# EAGLE schematic urdevboard (EAGLE 5.06)

## Sheet 1 of 11
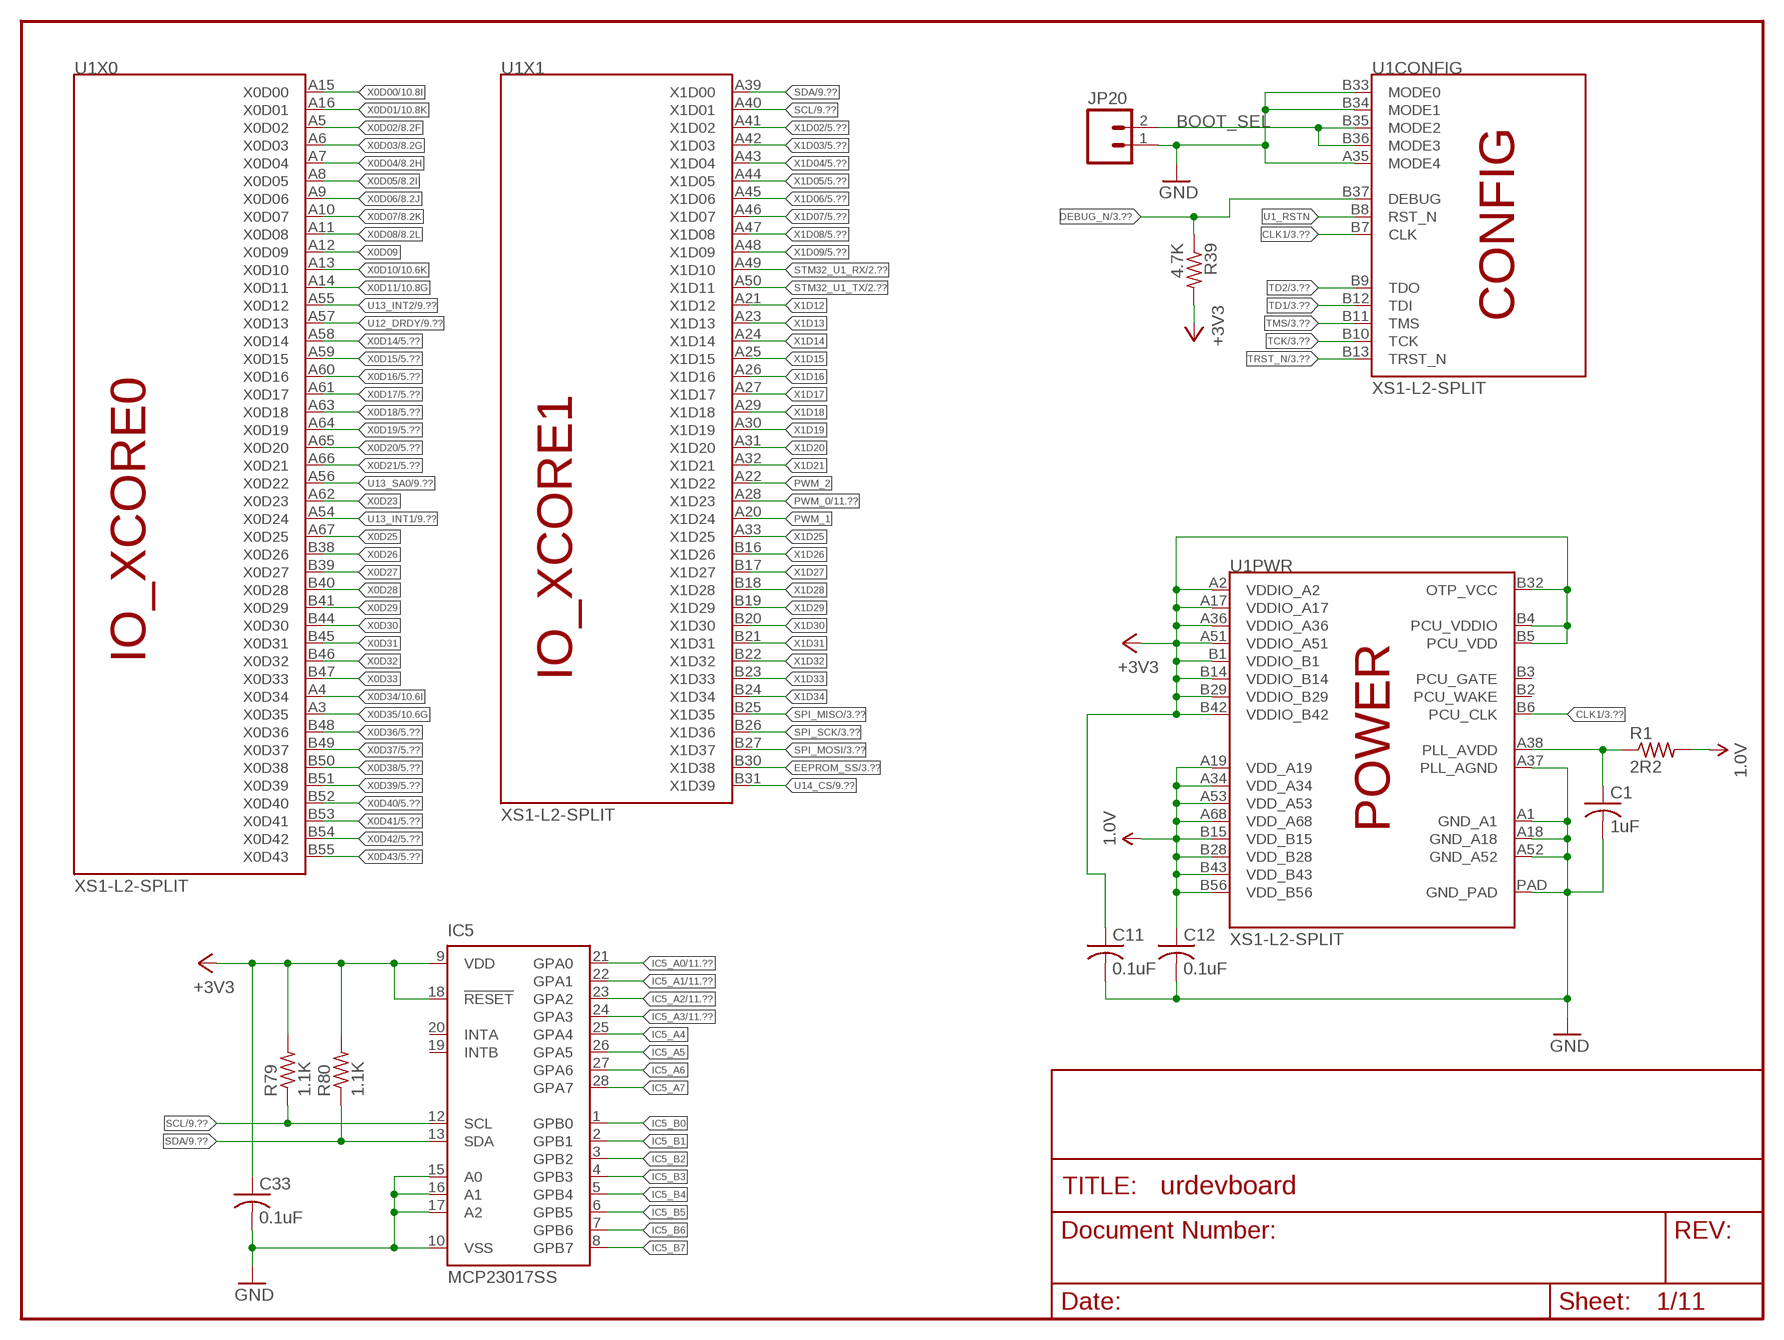
[diagram p0: schematic, sheet 1]

### Parts
C1  1uF  C-USC0603  [C0603]
C11  0.1uF  C-USC0603  [C0603]
C12  0.1uF  C-USC0603  [C0603]
C33  0.1uF  C-USC0603  [C0603]
IC5  MCP23017SS  [SSOP28]
JP20  M02PTH  [1X02]
R1  2R2  R-US_R0603  [R0603]
R39  4.7K  R-US_R0603  [R0603]
R79  1.1K  R-US_R0603  [R0603]
R80  1.1K  R-US_R0603  [R0603]
U1  XS1-L2-SPLIT  [124QFN]

### Nets
1.0V: C12.1 R1.2 U1.A19(PWR:VDD_A19) U1.A34(PWR:VDD_A34) U1.A53(PWR:VDD_A53) U1.A68(PWR:VDD_A68) U1.B15(PWR:VDD_B15) U1.B28(PWR:VDD_B28) U1.B43(PWR:VDD_B43) U1.B56(PWR:VDD_B56) ; also sheet 4
+3V3: C11.1 C33.1 IC5.9(VDD) IC5.18(!RESET) R39.2 R79.2 R80.2 U1.A2(PWR:VDDIO_A2) U1.A17(PWR:VDDIO_A17) U1.A36(PWR:VDDIO_A36) U1.A51(PWR:VDDIO_A51) U1.B1(PWR:VDDIO_B1) U1.B4(PWR:PCU_VDDIO) U1.B5(PWR:PCU_VDD) U1.B14(PWR:VDDIO_B14) U1.B29(PWR:VDDIO_B29) U1.B32(PWR:OTP_VCC) U1.B42(PWR:VDDIO_B42) ; also sheet 2,3,4,5,6,7,8,9,11
BOOT_SEL: JP20.2 U1.B35(CONFIG:MODE2) U1.B36(CONFIG:MODE3)
CLK1: U1.B6(PWR:PCU_CLK) U1.B7(CONFIG:CLK) ; also sheet 3
DEBUG_N: R39.1 U1.B37(CONFIG:DEBUG) ; also sheet 3
EEPROM_SS: U1.B30(X1:X1D38) ; also sheet 3
GND: C1.2 C11.2 C12.2 C33.2 IC5.10(VSS) IC5.15(A0) IC5.16(A1) IC5.17(A2) JP20.1 U1.A1(PWR:GND_A1) U1.A18(PWR:GND_A18) U1.A35(CONFIG:MODE4) U1.A37(PWR:PLL_AGND) U1.A52(PWR:GND_A52) U1.B33(CONFIG:MODE0) U1.B34(CONFIG:MODE1) U1.PAD(PWR:GND_PAD) ; also sheet 2,3,4,5,9,10,11
IC5_A0: IC5.21(GPA0) ; also sheet 11
IC5_A1: IC5.22(GPA1) ; also sheet 11
IC5_A2: IC5.23(GPA2) ; also sheet 11
IC5_A3: IC5.24(GPA3) ; also sheet 11
IC5_A4: IC5.25(GPA4)
IC5_A5: IC5.26(GPA5)
IC5_A6: IC5.27(GPA6)
IC5_A7: IC5.28(GPA7)
IC5_B0: IC5.1(GPB0)
IC5_B1: IC5.2(GPB1)
IC5_B2: IC5.3(GPB2)
IC5_B3: IC5.4(GPB3)
IC5_B4: IC5.5(GPB4)
IC5_B5: IC5.6(GPB5)
IC5_B6: IC5.7(GPB6)
IC5_B7: IC5.8(GPB7)
PWM_0: U1.A28(X1:X1D23) ; also sheet 11
PWM_1: U1.A20(X1:X1D24)
PWM_2: U1.A22(X1:X1D22)
SCL: IC5.12(SCL) R79.1 U1.A40(X1:X1D01) ; also sheet 9
SDA: IC5.13(SDA) R80.1 U1.A39(X1:X1D00) ; also sheet 9
SPI_MISO: U1.B25(X1:X1D35) ; also sheet 3,9
SPI_MOSI: U1.B27(X1:X1D37) ; also sheet 3,9
SPI_SCK: U1.B26(X1:X1D36) ; also sheet 3,9
STM32_U1_RX: U1.A49(X1:X1D10) ; also sheet 2
STM32_U1_TX: U1.A50(X1:X1D11) ; also sheet 2
TCK: U1.B10(CONFIG:TCK) ; also sheet 3
TD1: U1.B12(CONFIG:TDI) ; also sheet 3
TD2: U1.B9(CONFIG:TDO) ; also sheet 3
TMS: U1.B11(CONFIG:TMS) ; also sheet 3
TRST_N: U1.B13(CONFIG:TRST_N) ; also sheet 3
U1_PLL_AVDD: C1.1 R1.1 U1.A38(PWR:PLL_AVDD)
U1_RSTN: U1.B8(CONFIG:RST_N)
U12_DRDY: U1.A57(X0:X0D13) ; also sheet 9
U13_INT1: U1.A54(X0:X0D24) ; also sheet 9
U13_INT2: U1.A55(X0:X0D12) ; also sheet 9
U13_SA0: U1.A56(X0:X0D22) ; also sheet 9
U14_CS: U1.B31(X1:X1D39) ; also sheet 9
X0D00: U1.A15(X0:X0D00) ; also sheet 10
X0D01: U1.A16(X0:X0D01) ; also sheet 10
X0D02: U1.A5(X0:X0D02) ; also sheet 8
X0D03: U1.A6(X0:X0D03) ; also sheet 8
X0D04: U1.A7(X0:X0D04) ; also sheet 8
X0D05: U1.A8(X0:X0D05) ; also sheet 8
X0D06: U1.A9(X0:X0D06) ; also sheet 8
X0D07: U1.A10(X0:X0D07) ; also sheet 8
X0D08: U1.A11(X0:X0D08) ; also sheet 8
X0D09: U1.A12(X0:X0D09)
X0D10: U1.A13(X0:X0D10) ; also sheet 10
X0D11: U1.A14(X0:X0D11) ; also sheet 10
X0D14: U1.A58(X0:X0D14) ; also sheet 5
X0D15: U1.A59(X0:X0D15) ; also sheet 5
X0D16: U1.A60(X0:X0D16) ; also sheet 5
X0D17: U1.A61(X0:X0D17) ; also sheet 5
X0D18: U1.A63(X0:X0D18) ; also sheet 5
X0D19: U1.A64(X0:X0D19) ; also sheet 5
X0D20: U1.A65(X0:X0D20) ; also sheet 5
X0D21: U1.A66(X0:X0D21) ; also sheet 5
X0D23: U1.A62(X0:X0D23)
X0D25: U1.A67(X0:X0D25)
X0D26: U1.B38(X0:X0D26)
X0D27: U1.B39(X0:X0D27)
X0D28: U1.B40(X0:X0D28)
X0D29: U1.B41(X0:X0D29)
X0D30: U1.B44(X0:X0D30)
X0D31: U1.B45(X0:X0D31)
X0D32: U1.B46(X0:X0D32)
X0D33: U1.B47(X0:X0D33)
X0D34: U1.A4(X0:X0D34) ; also sheet 10
X0D35: U1.A3(X0:X0D35) ; also sheet 10
X0D36: U1.B48(X0:X0D36) ; also sheet 5
X0D37: U1.B49(X0:X0D37) ; also sheet 5
X0D38: U1.B50(X0:X0D38) ; also sheet 5
X0D39: U1.B51(X0:X0D39) ; also sheet 5
X0D40: U1.B52(X0:X0D40) ; also sheet 5
X0D41: U1.B53(X0:X0D41) ; also sheet 5
X0D42: U1.B54(X0:X0D42) ; also sheet 5
X0D43: U1.B55(X0:X0D43) ; also sheet 5
X1D02: U1.A41(X1:X1D02) ; also sheet 5
X1D03: U1.A42(X1:X1D03) ; also sheet 5
X1D04: U1.A43(X1:X1D04) ; also sheet 5
X1D05: U1.A44(X1:X1D05) ; also sheet 5
X1D06: U1.A45(X1:X1D06) ; also sheet 5
X1D07: U1.A46(X1:X1D07) ; also sheet 5
X1D08: U1.A47(X1:X1D08) ; also sheet 5
X1D09: U1.A48(X1:X1D09) ; also sheet 5
X1D12: U1.A21(X1:X1D12)
X1D13: U1.A23(X1:X1D13)
X1D14: U1.A24(X1:X1D14)
X1D15: U1.A25(X1:X1D15)
X1D16: U1.A26(X1:X1D16)
X1D17: U1.A27(X1:X1D17)
X1D18: U1.A29(X1:X1D18)
X1D19: U1.A30(X1:X1D19)
X1D20: U1.A31(X1:X1D20)
X1D21: U1.A32(X1:X1D21)
X1D25: U1.A33(X1:X1D25)
X1D26: U1.B16(X1:X1D26)
X1D27: U1.B17(X1:X1D27)
X1D28: U1.B18(X1:X1D28)
X1D29: U1.B19(X1:X1D29)
X1D30: U1.B20(X1:X1D30)
X1D31: U1.B21(X1:X1D31)
X1D32: U1.B22(X1:X1D32)
X1D33: U1.B23(X1:X1D33)
X1D34: U1.B24(X1:X1D34)
Unconnected: IC5.19(INTB) IC5.20(INTA) U1.B2(PWR:PCU_WAKE) U1.B3(PWR:PCU_GATE)

## Sheet 2 of 11
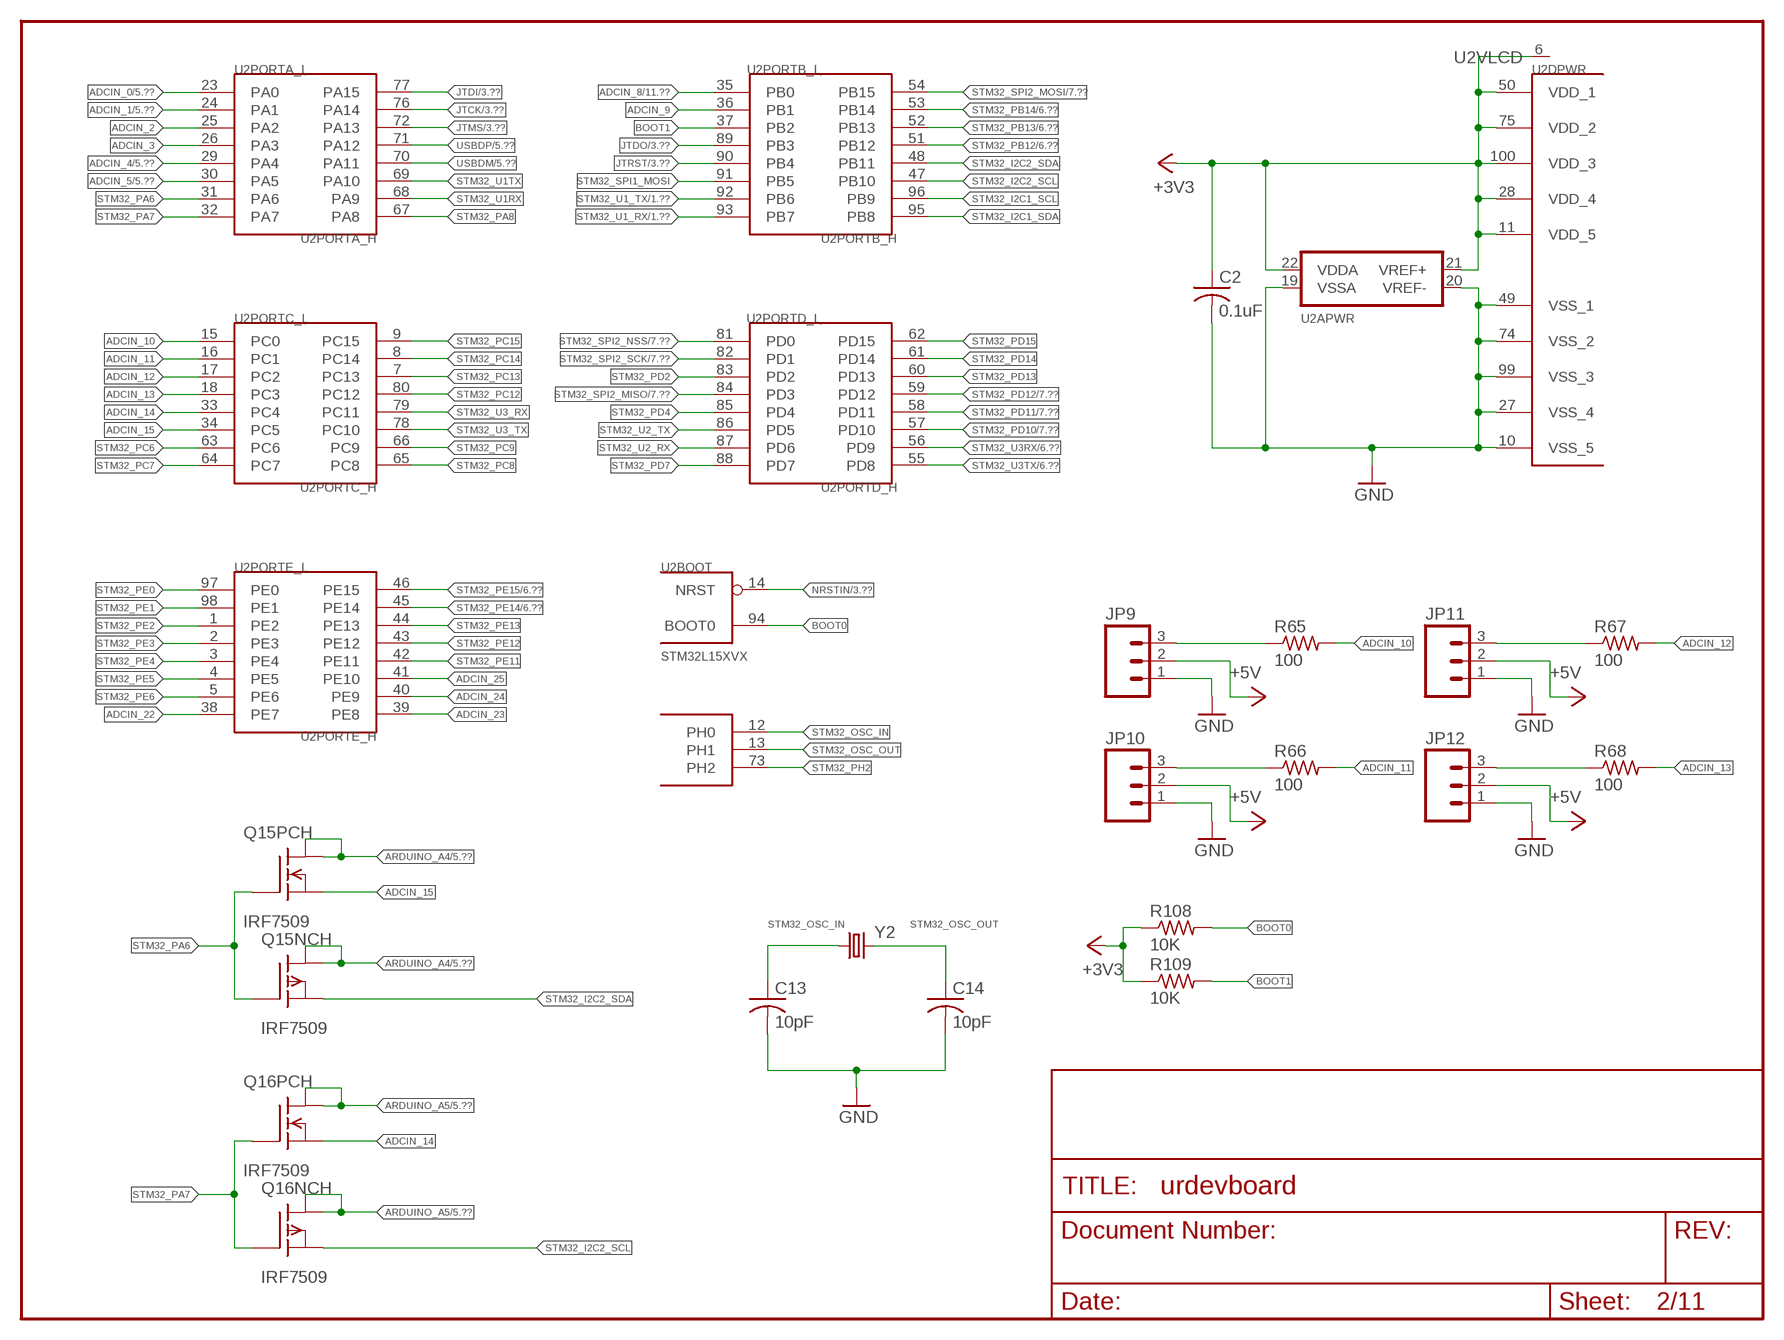
[diagram p1: schematic, sheet 2]

### Parts
C2  0.1uF  C-USC0603  [C0603]
C13  10pF  C-USC0603  [C0603]
C14  10pF  C-USC0603  [C0603]
JP9  M03PTH  [1X03]
JP10  M03PTH  [1X03]
JP11  M03PTH  [1X03]
JP12  M03PTH  [1X03]
Q15  IRF7509  IRF7509"  [MICRO8]
Q16  IRF7509  IRF7509"  [MICRO8]
R65  100  R-US_R0603  [R0603]
R66  100  R-US_R0603  [R0603]
R67  100  R-US_R0603  [R0603]
R68  100  R-US_R0603  [R0603]
R108  10K  R-US_R0603  [R0603]
R109  10K  R-US_R0603  [R0603]
U2  STM32L15XVX  [LQFP100]
Y2  CRYSTALHC49US  [HC49US]

### Nets
+3V3: C2.1 R108.1 R109.1 U2.11(DPWR:VDD_5) U2.21(APWR:VREF+) U2.22(APWR:VDDA) U2.28(DPWR:VDD_4) U2.50(DPWR:VDD_1) U2.75(DPWR:VDD_2) U2.100(DPWR:VDD_3) ; also sheet 1,3,4,5,6,7,8,9,11
+5V: JP9.2 JP10.2 JP11.2 JP12.2 ; also sheet 4,5,6,7,8
ADCIN_0: U2.23(PORTA_L:PA0) ; also sheet 5
ADCIN_1: U2.24(PORTA_L:PA1) ; also sheet 5
ADCIN_2: U2.25(PORTA_L:PA2)
ADCIN_3: U2.26(PORTA_L:PA3)
ADCIN_4: U2.29(PORTA_L:PA4) ; also sheet 5
ADCIN_5: U2.30(PORTA_L:PA5) ; also sheet 5
ADCIN_8: U2.35(PORTB_L:PB0) ; also sheet 11
ADCIN_9: U2.36(PORTB_L:PB1)
ADCIN_10: R65.2 U2.15(PORTC_L:PC0)
ADCIN_11: R66.2 U2.16(PORTC_L:PC1)
ADCIN_12: R67.2 U2.17(PORTC_L:PC2)
ADCIN_13: R68.2 U2.18(PORTC_L:PC3)
ADCIN_14: Q16.1(PCH:S) U2.33(PORTC_L:PC4)
ADCIN_15: Q15.1(PCH:S) U2.34(PORTC_L:PC5)
ADCIN_22: U2.38(PORTE_L:PE7)
ADCIN_23: U2.39(PORTE_H:PE8)
ADCIN_24: U2.40(PORTE_H:PE9)
ADCIN_25: U2.41(PORTE_H:PE10)
ARDUINO_A4: Q15.5(NCH:D) Q15.6(NCH:D1) Q15.7(PCH:D) Q15.8(PCH:D1) ; also sheet 5
ARDUINO_A5: Q16.5(NCH:D) Q16.6(NCH:D1) Q16.7(PCH:D) Q16.8(PCH:D1) ; also sheet 5
BOOT0: R108.2 U2.94(BOOT:BOOT0)
BOOT1: R109.2 U2.37(PORTB_L:PB2)
EXTERNAL_ADC_0: JP9.3 R65.1
EXTERNAL_ADC_1: JP10.3 R66.1
EXTERNAL_ADC_2: JP11.3 R67.1
EXTERNAL_ADC_3: JP12.3 R68.1
GND: C2.2 C13.2 C14.2 JP9.1 JP10.1 JP11.1 JP12.1 U2.10(DPWR:VSS_5) U2.19(APWR:VSSA) U2.20(APWR:VREF-) U2.27(DPWR:VSS_4) U2.49(DPWR:VSS_1) U2.74(DPWR:VSS_2) U2.99(DPWR:VSS_3) ; also sheet 1,3,4,5,9,10,11
JTCK: U2.76(PORTA_H:PA14) ; also sheet 3
JTDI: U2.77(PORTA_H:PA15) ; also sheet 3
JTDO: U2.89(PORTB_L:PB3) ; also sheet 3
JTMS: U2.72(PORTA_H:PA13) ; also sheet 3
JTRST: U2.90(PORTB_L:PB4) ; also sheet 3
NRSTIN: U2.14(BOOT:NRST) ; also sheet 3,5
STM32_I2C1_SCL: U2.96(PORTB_H:PB9)
STM32_I2C1_SDA: U2.95(PORTB_H:PB8)
STM32_I2C2_SCL: Q16.3(NCH:S) U2.47(PORTB_H:PB10)
STM32_I2C2_SDA: Q15.3(NCH:S) U2.48(PORTB_H:PB11)
STM32_OSC_IN: C13.1 U2.12(PORTH:PH0) Y2.1
STM32_OSC_OUT: C14.1 U2.13(PORTH:PH1) Y2.2
STM32_PA6: Q15.2(PCH:G) Q15.4(NCH:G) U2.31(PORTA_L:PA6)
STM32_PA7: Q16.2(PCH:G) Q16.4(NCH:G) U2.32(PORTA_L:PA7)
STM32_PA8: U2.67(PORTA_H:PA8)
STM32_PB12: U2.51(PORTB_H:PB12) ; also sheet 6
STM32_PB13: U2.52(PORTB_H:PB13) ; also sheet 6
STM32_PB14: U2.53(PORTB_H:PB14) ; also sheet 6
STM32_PC6: U2.63(PORTC_L:PC6)
STM32_PC7: U2.64(PORTC_L:PC7)
STM32_PC8: U2.65(PORTC_H:PC8)
STM32_PC9: U2.66(PORTC_H:PC9)
STM32_PC12: U2.80(PORTC_H:PC12)
STM32_PC13: U2.7(PORTC_H:PC13)
STM32_PC14: U2.8(PORTC_H:PC14)
STM32_PC15: U2.9(PORTC_H:PC15)
STM32_PD2: U2.83(PORTD_L:PD2)
STM32_PD4: U2.85(PORTD_L:PD4)
STM32_PD7: U2.88(PORTD_L:PD7)
STM32_PD10: U2.57(PORTD_H:PD10) ; also sheet 7
STM32_PD11: U2.58(PORTD_H:PD11) ; also sheet 7
STM32_PD12: U2.59(PORTD_H:PD12) ; also sheet 7
STM32_PD13: U2.60(PORTD_H:PD13)
STM32_PD14: U2.61(PORTD_H:PD14)
STM32_PD15: U2.62(PORTD_H:PD15)
STM32_PE0: U2.97(PORTE_L:PE0)
STM32_PE1: U2.98(PORTE_L:PE1)
STM32_PE2: U2.1(PORTE_L:PE2)
STM32_PE3: U2.2(PORTE_L:PE3)
STM32_PE4: U2.3(PORTE_L:PE4)
STM32_PE5: U2.4(PORTE_L:PE5)
STM32_PE6: U2.5(PORTE_L:PE6)
STM32_PE11: U2.42(PORTE_H:PE11)
STM32_PE12: U2.43(PORTE_H:PE12)
STM32_PE13: U2.44(PORTE_H:PE13)
STM32_PE14: U2.45(PORTE_H:PE14) ; also sheet 6
STM32_PE15: U2.46(PORTE_H:PE15) ; also sheet 6
STM32_PH2: U2.73(PORTH:PH2)
STM32_SPI1_MOSI: U2.91(PORTB_L:PB5)
STM32_SPI2_MISO: U2.84(PORTD_L:PD3) ; also sheet 7
STM32_SPI2_MOSI: U2.54(PORTB_H:PB15) ; also sheet 7
STM32_SPI2_NSS: U2.81(PORTD_L:PD0) ; also sheet 7
STM32_SPI2_SCK: U2.82(PORTD_L:PD1) ; also sheet 7
STM32_U1_RX: U2.93(PORTB_L:PB7) ; also sheet 1
STM32_U1_TX: U2.92(PORTB_L:PB6) ; also sheet 1
STM32_U1RX: U2.68(PORTA_H:PA9)
STM32_U1TX: U2.69(PORTA_H:PA10)
STM32_U2_RX: U2.87(PORTD_L:PD6)
STM32_U2_TX: U2.86(PORTD_L:PD5)
STM32_U3_RX: U2.79(PORTC_H:PC11)
STM32_U3_TX: U2.78(PORTC_H:PC10)
STM32_U3RX: U2.56(PORTD_H:PD9) ; also sheet 6
STM32_U3TX: U2.55(PORTD_H:PD8) ; also sheet 6
USBDM: U2.70(PORTA_H:PA11) ; also sheet 5
USBDP: U2.71(PORTA_H:PA12) ; also sheet 5

## Sheet 3 of 11
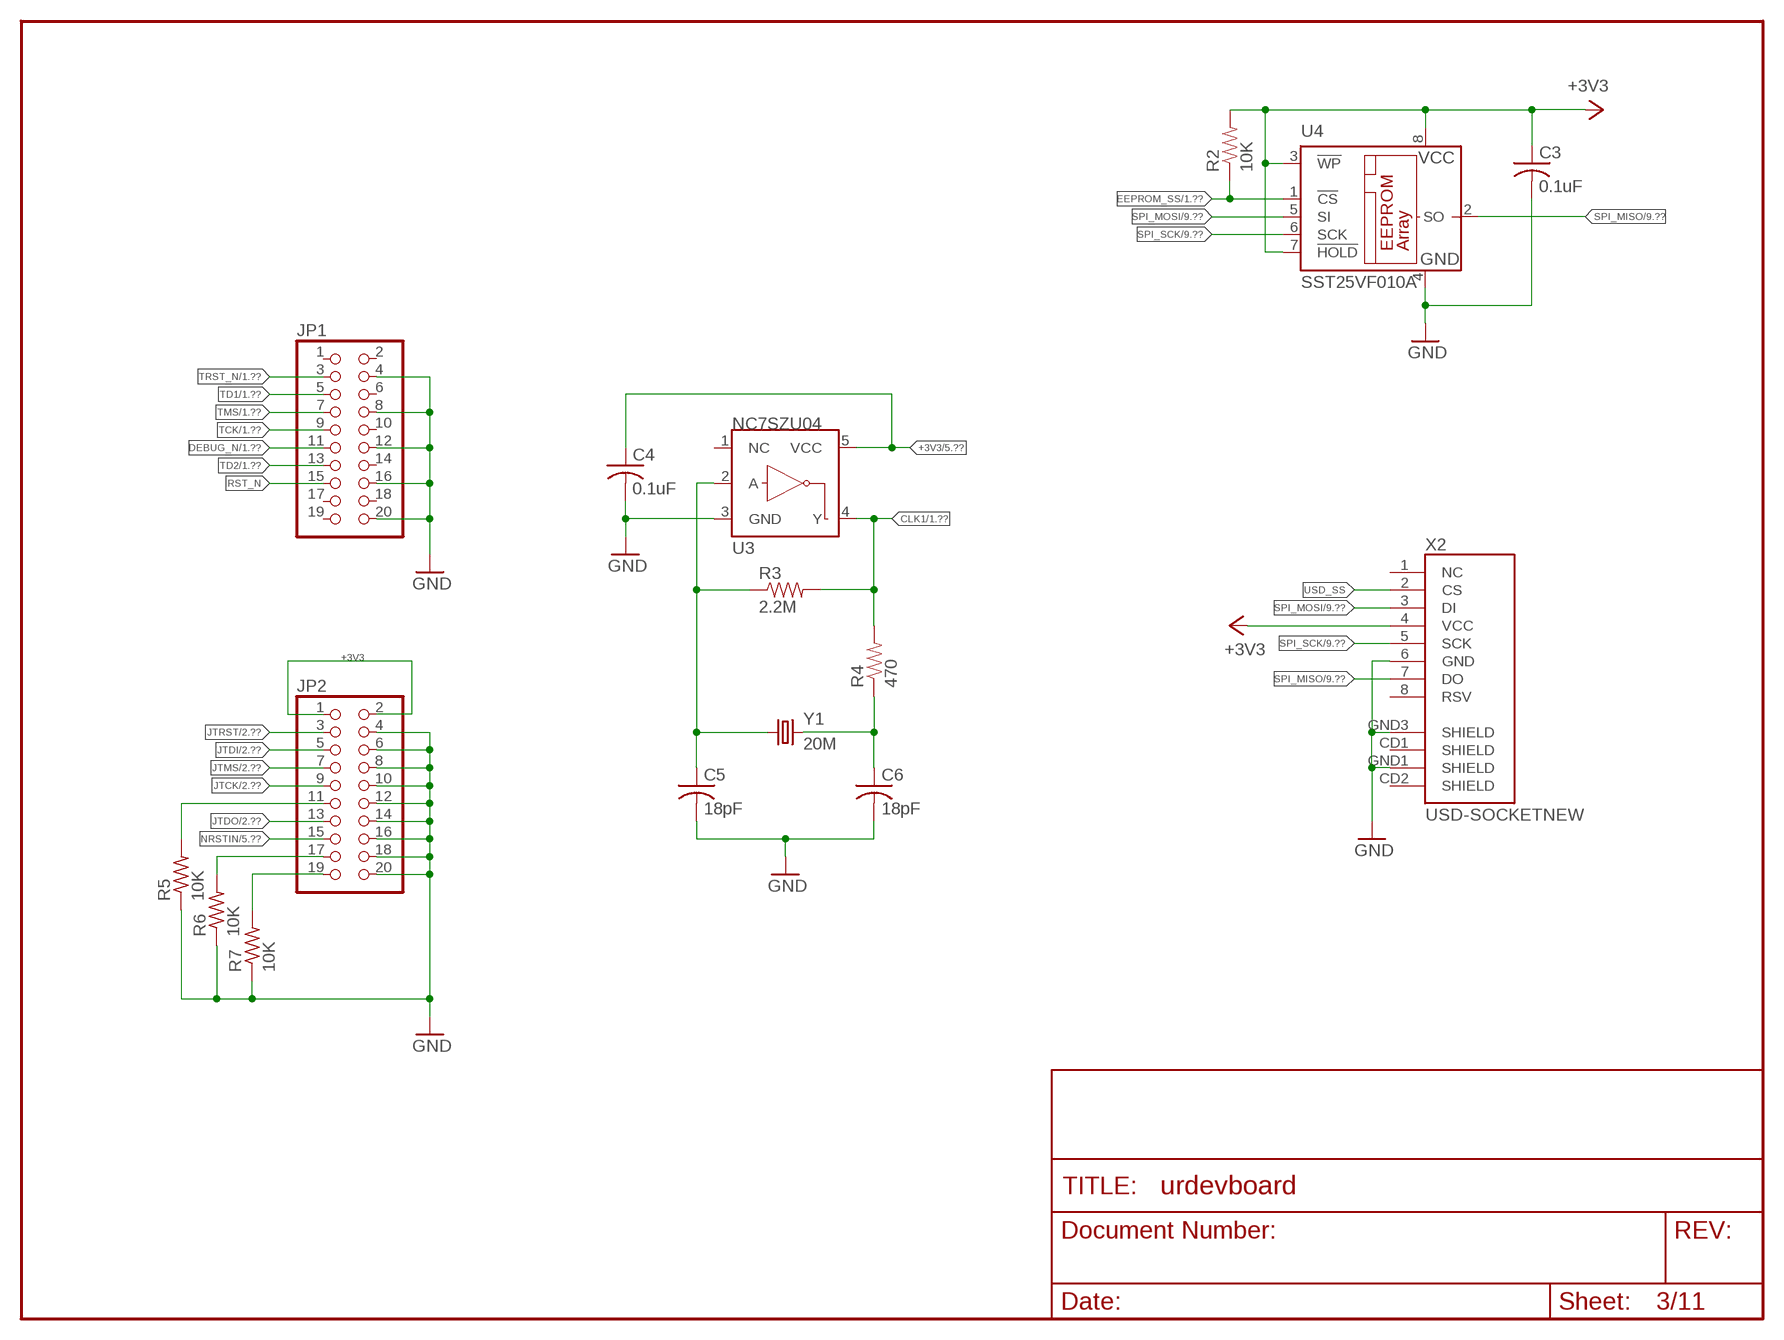
[diagram p2: schematic, sheet 3]

### Parts
C3  0.1uF  C-USC0603  [C0603]
C4  0.1uF  C-USC0603  [C0603]
C5  18pF  C-USC0603  [C0603]
C6  18pF  C-USC0603  [C0603]
JP1  PINHD-2X10  [2X10]
JP2  PINHD-2X10  [2X10]
R2  10K  RESISTOR0603-RES  [0603-RES]
R3  2.2M  RESISTOR0603-RES  [0603-RES]
R4  470  RESISTOR0603-RES  [0603-RES]
R5  10K  R-US_R0603  [R0603]
R6  10K  R-US_R0603  [R0603]
R7  10K  R-US_R0603  [R0603]
U3  NC7SZU04  INVERTER""  [SC70]
U4  SST25VF010A  25LC080SN  [SO-08]
X2  USD-SOCKETNEW  [MICRO-SD-SOCKET-PP]
Y1  20M  CRYSTALHC49US  [HC49US]

### Nets
+3V3: C3.1 C4.1 JP2.1 JP2.2 R2.2 U3.5(VCC) U4.3(!WP) U4.7(!HOLD) U4.8(VCC) X2.4(VCC) ; also sheet 1,2,4,5,6,7,8,9,11
CLK1: R3.2 R4.2 U3.4(Y) ; also sheet 1
DBGACK: JP2.19 R7.2
DBGRQ: JP2.17 R6.2
DEBUG_N: JP1.11 ; also sheet 1
EEPROM_SS: R2.1 U4.1(!CS) ; also sheet 1
GND: C3.2 C4.2 C5.2 C6.2 JP1.4 JP1.8 JP1.12 JP1.16 JP1.20 JP2.4 JP2.6 JP2.8 JP2.10 JP2.12 JP2.14 JP2.16 JP2.18 JP2.20 R5.1 R6.1 R7.1 U3.3(GND) U4.4(GND) X2.6(GND) X2.GND1(SHIELD) X2.GND3(SHIELD) ; also sheet 1,2,4,5,9,10,11
JTCK: JP2.9 ; also sheet 2
JTDI: JP2.5 ; also sheet 2
JTDO: JP2.13 ; also sheet 2
JTMS: JP2.7 ; also sheet 2
JTRST: JP2.3 ; also sheet 2
NRSTIN: JP2.15 ; also sheet 2,5
RST_N: JP1.15
RTCK: JP2.11 R5.2
SPI_MISO: U4.2(SO) X2.7(DO) ; also sheet 1,9
SPI_MOSI: U4.5(SI) X2.3(DI) ; also sheet 1,9
SPI_SCK: U4.6(SCK) X2.5(SCK) ; also sheet 1,9
TCK: JP1.9 ; also sheet 1
TD1: JP1.5 ; also sheet 1
TD2: JP1.13 ; also sheet 1
TMS: JP1.7 ; also sheet 1
TRST_N: JP1.3 ; also sheet 1
USD_SS: X2.2(CS)
Y1INVA-: C5.1 R3.1 U3.2(A) Y1.1
Y1RES: C6.1 R4.1 Y1.2
Unconnected: JP1.1 JP1.2 JP1.6 JP1.10 JP1.14 JP1.17 JP1.18 JP1.19 U3.1(NC) X2.1(NC) X2.8(RSV) X2.CD1(SHIELD) X2.CD2(SHIELD)

## Sheet 4 of 11
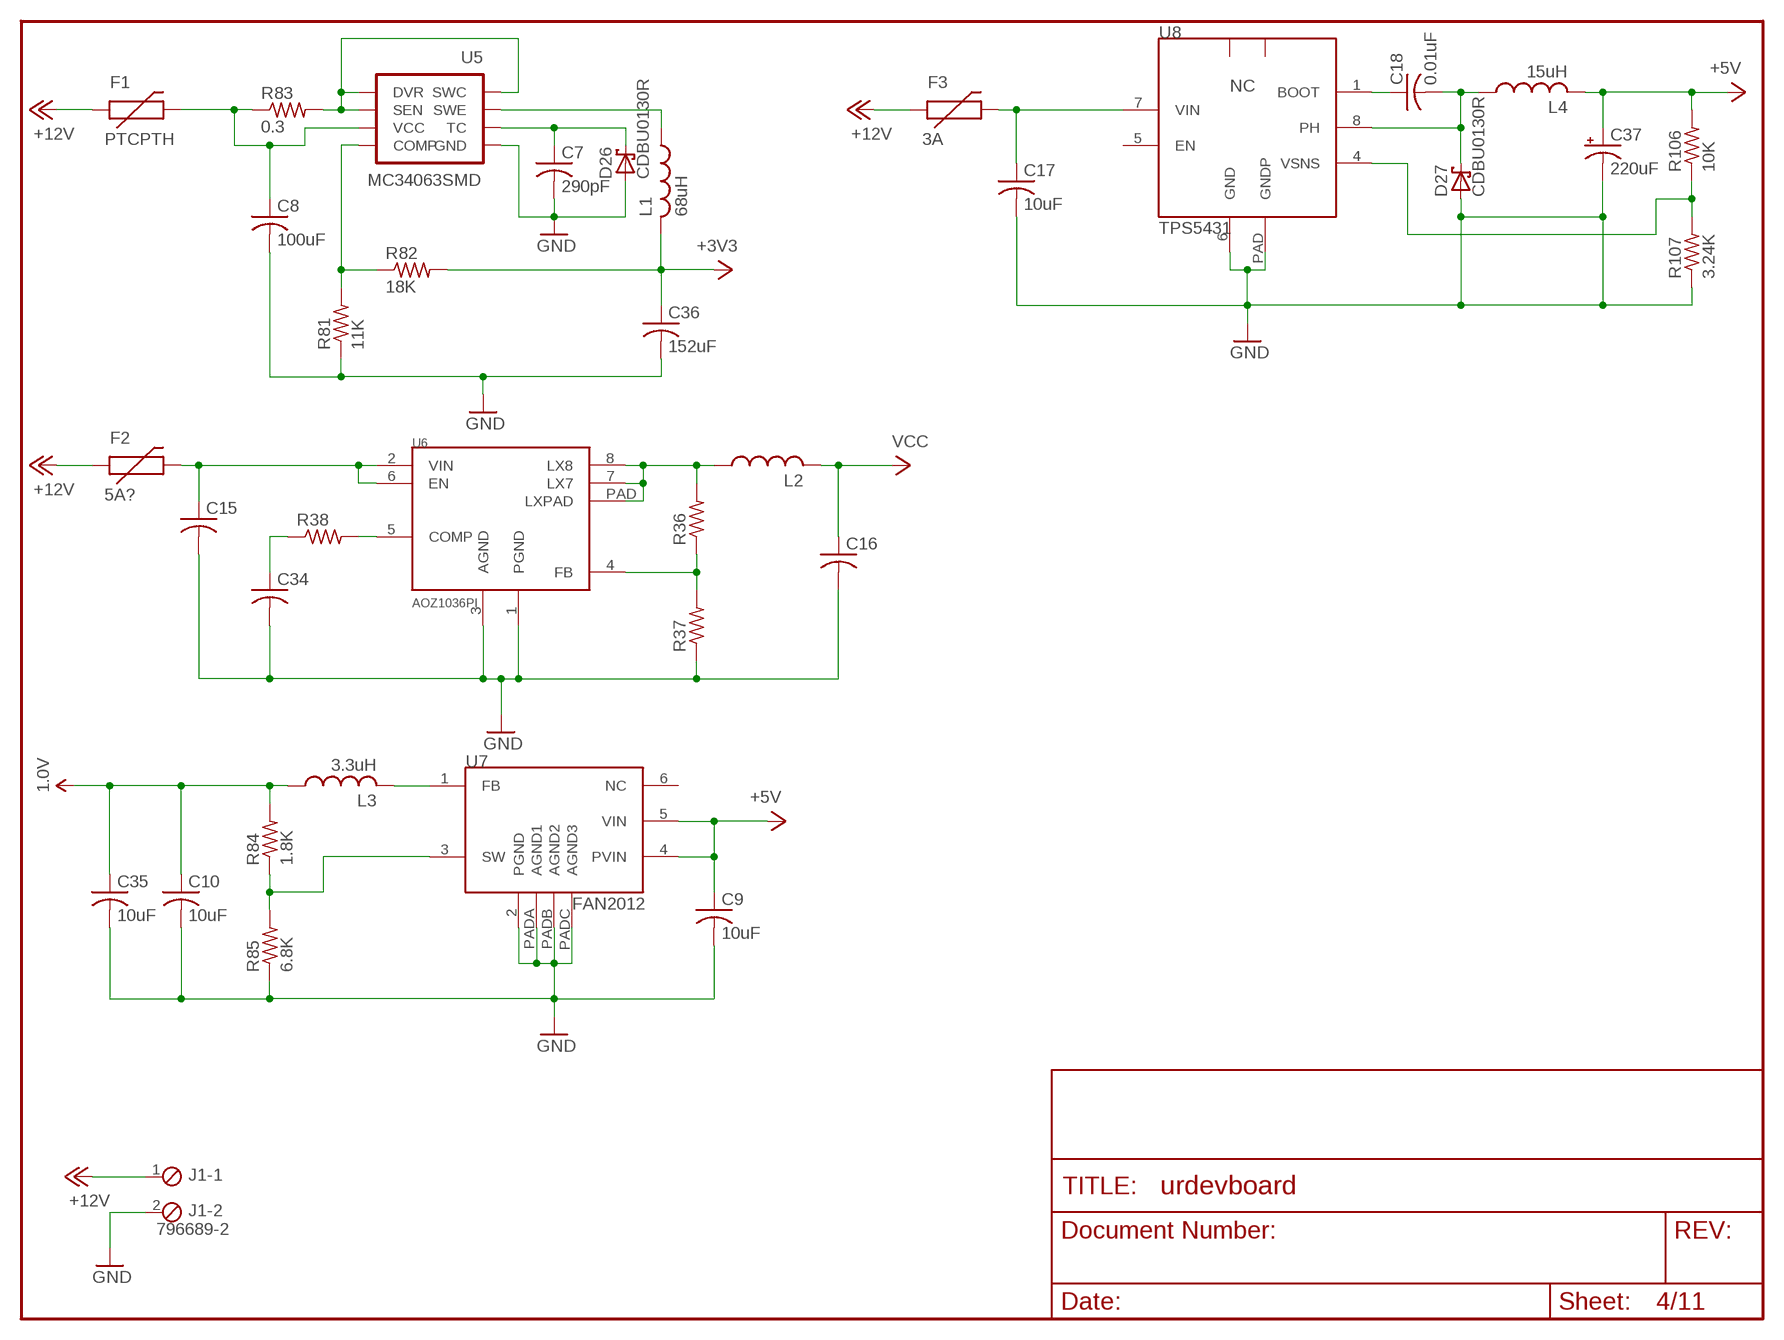
[diagram p3: schematic, sheet 4]

### Parts
C7  290pF  C-USC0603  [C0603]
C8  100uF  C-USC0805  [C0805]
C9  10uF  C-USC0805  [C0805]
C10  10uF  C-USC0805  [C0805]
C15  C-USC1206  [C1206]
C16  C-USC0603  [C0603]
C17  10uF  C-USC0805  [C0805]
C18  0.01uF  C-USC0603  [C0603]
C34  C-USC0603  [C0603]
C35  10uF  C-USC0805  [C0805]
C36  152uF  C-USC0805  [C0805]
C37  220uF  CPOL-USD  [PANASONIC_D]
D26  CDBU0130R  [D0603]
D27  CDBU0130R  [D0603]
F1  PTCPTH  [PTC]
F2  5A?  PTCPTH  [PTC]
F3  3A  PTCPTH  [PTC]
J1  796689-2  [796689-2]
L1  68uH  L-USSLF12565  [SLF12565]
L2  L-USSLF12565  [SLF12565]
L3  3.3uH  L-USPANASONIC_ELL6  [PANASONIC_ELL6]
L4  15uH  L-USIHLP-3232DZ  [IHLP-3232DZ]
R36  R-US_R1206  [R1206]
R37  R-US_R0603  [R0603]
R38  R-US_R0603  [R0603]
R81  11K  R-US_R0603  [R0603]
R82  18K  R-US_R0603  [R0603]
R83  0.3  R-US_R0603  [R0603]
R84  1.8K  R-US_R0603  [R0603]
R85  6.8K  R-US_R0603  [R0603]
R106  10K  R-US_R0603  [R0603]
R107  3.24K  R-US_R0603  [R0603]
U5  MC34063SMD  [SO08]
U6  AOZ1036PI  [SO8_EP1]
U7  FAN2012  [MLP6]
U8  TPS5431  [R-PDSO-G08]

### Nets
1.0V: C10.1 C35.1 L3.1 R84.2 ; also sheet 1
+3V3: C36.1 L1.2 R82.2 ; also sheet 1,2,3,5,6,7,8,9,11
+5V: C9.1 C37.+ L4.2 R106.2 U7.4(PVIN) U7.5(VIN) ; also sheet 2,5,6,7,8
+12V: F1.P$1 F2.P$1 F3.P$1 J1.1 ; also sheet 11
F3_OUT: C17.1 F3.P$2 U8.7(VIN)
GND: C7.2 C8.2 C9.2 C10.2 C15.2 C16.2 C17.2 C34.2 C35.2 C36.2 C37.- D26.A D27.A J1.2 R37.1 R81.1 R85.1 R107.1 U5.4(GND) U6.1(PGND) U6.3(AGND) U7.2(PGND) U7.PADA(AGND1) U7.PADB(AGND2) U7.PADC(AGND3) U8.6(GND) U8.PAD(GNDP) ; also sheet 1,2,3,5,9,10,11
U5_COMP: R81.2 R82.1 U5.5(COMP)
U5_FB: R36.1 R37.2 U6.4(FB)
U5_SWC: R83.2 U5.1(SWC) U5.7(SEN) U5.8(DVR)
U5_SWE: L1.1 U5.2(SWE)
U5_TC: C7.1 D26.C U5.3(TC)
U5_VCC: C8.1 F1.P$2 R83.1 U5.6(VCC)
U6_COMP: R38.2 U6.5(COMP)
U6_LX: L2.1 R36.2 U6.7(LX7) U6.8(LX8) U6.PAD(LXPAD)
U6_RC: C34.1 R38.1
U6_VIN: C15.1 F2.P$2 U6.2(VIN) U6.6(EN)
U7_FB: L3.2 U7.1(FB)
U7_SW: R84.1 R85.2 U7.3(SW)
U8_BOOT: C18.1 U8.1(BOOT)
U8_PH: C18.2 D27.C L4.1 U8.8(PH)
U8_VSNS: R106.1 R107.2 U8.4(VSNS)
VCC: C16.1 L2.2 ; also sheet 10
Unconnected: U7.6(NC) U8.2(NC1) U8.3(NC2) U8.5(EN)

## Sheet 5 of 11
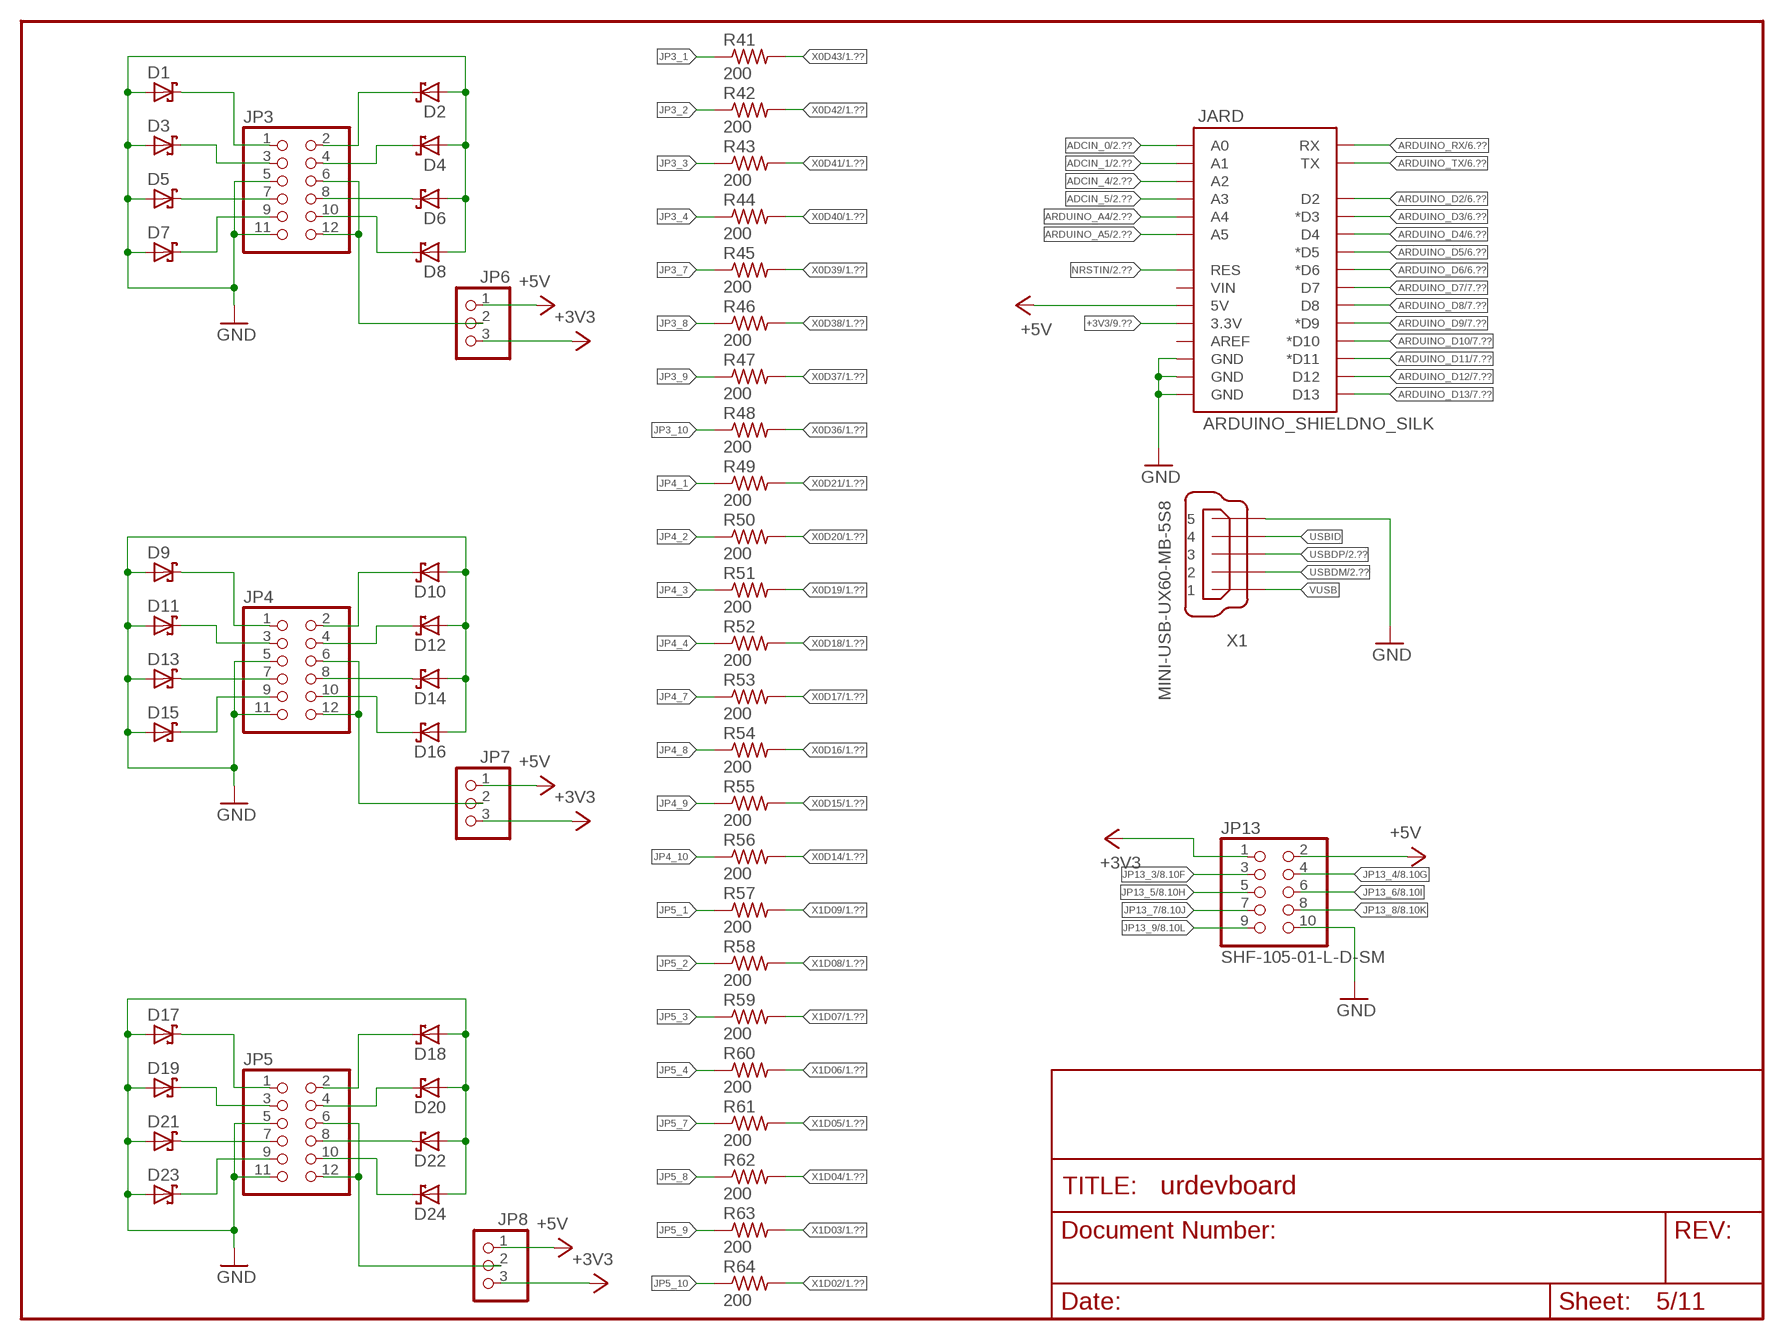
[diagram p4: schematic, sheet 5]

### Parts
D1  CDBU0130R  [D0603]
D2  CDBU0130R  [D0603]
D3  CDBU0130R  [D0603]
D4  CDBU0130R  [D0603]
D5  CDBU0130R  [D0603]
D6  CDBU0130R  [D0603]
D7  CDBU0130R  [D0603]
D8  CDBU0130R  [D0603]
D9  CDBU0130R  [D0603]
D10  CDBU0130R  [D0603]
D11  CDBU0130R  [D0603]
D12  CDBU0130R  [D0603]
D13  CDBU0130R  [D0603]
D14  CDBU0130R  [D0603]
D15  CDBU0130R  [D0603]
D16  CDBU0130R  [D0603]
D17  CDBU0130R  [D0603]
D18  CDBU0130R  [D0603]
D19  CDBU0130R  [D0603]
D20  CDBU0130R  [D0603]
D21  CDBU0130R  [D0603]
D22  CDBU0130R  [D0603]
D23  CDBU0130R  [D0603]
D24  CDBU0130R  [D0603]
JARD  ARDUINO_SHIELDNO_SILK  [DUEMILANOVE_VIAS]
JP3  PINHD-2X6  [2X06]
JP4  PINHD-2X6  [2X06]
JP5  PINHD-2X6  [2X06]
JP6  PINHD-1X3  [1X03]
JP7  PINHD-1X3  [1X03]
JP8  PINHD-1X3  [1X03]
JP13  SHF-105-01-L-D-SM  [SHF-105-01-L-D-SM]
R41  200  R-US_R0603  [R0603]
R42  200  R-US_R0603  [R0603]
R43  200  R-US_R0603  [R0603]
R44  200  R-US_R0603  [R0603]
R45  200  R-US_R0603  [R0603]
R46  200  R-US_R0603  [R0603]
R47  200  R-US_R0603  [R0603]
R48  200  R-US_R0603  [R0603]
R49  200  R-US_R0603  [R0603]
R50  200  R-US_R0603  [R0603]
R51  200  R-US_R0603  [R0603]
R52  200  R-US_R0603  [R0603]
R53  200  R-US_R0603  [R0603]
R54  200  R-US_R0603  [R0603]
R55  200  R-US_R0603  [R0603]
R56  200  R-US_R0603  [R0603]
R57  200  R-US_R0603  [R0603]
R58  200  R-US_R0603  [R0603]
R59  200  R-US_R0603  [R0603]
R60  200  R-US_R0603  [R0603]
R61  200  R-US_R0603  [R0603]
R62  200  R-US_R0603  [R0603]
R63  200  R-US_R0603  [R0603]
R64  200  R-US_R0603  [R0603]
X1  MINI-USB-UX60-MB-5S8  [UX60-MB-5S8]

### Nets
+3V3: JARD.3.3V JP6.3 JP7.3 JP8.3 JP13.1 ; also sheet 1,2,3,4,6,7,8,9,11
+5V: JARD.5V JP6.1 JP7.1 JP8.1 JP13.2 ; also sheet 2,4,6,7,8
ADCIN_0: JARD.A0 ; also sheet 2
ADCIN_1: JARD.A1 ; also sheet 2
ADCIN_4: JARD.A2 ; also sheet 2
ADCIN_5: JARD.A3 ; also sheet 2
ARDUINO_A4: JARD.A4 ; also sheet 2
ARDUINO_A5: JARD.A5 ; also sheet 2
ARDUINO_D2: JARD.D2 ; also sheet 6
ARDUINO_D3: JARD.D3(*D3) ; also sheet 6
ARDUINO_D4: JARD.D4 ; also sheet 6
ARDUINO_D5: JARD.D5(*D5) ; also sheet 6
ARDUINO_D6: JARD.D6(*D6) ; also sheet 6
ARDUINO_D7: JARD.D7 ; also sheet 7
ARDUINO_D8: JARD.D8 ; also sheet 7
ARDUINO_D9: JARD.D9(*D9) ; also sheet 7
ARDUINO_D10: JARD.D10(*D10) ; also sheet 7
ARDUINO_D11: JARD.D11(*D11) ; also sheet 7
ARDUINO_D12: JARD.D12 ; also sheet 7
ARDUINO_D13: JARD.D13 ; also sheet 7
ARDUINO_RX: JARD.RX ; also sheet 6
ARDUINO_TX: JARD.TX ; also sheet 6
GND: D1.A D2.A D3.A D4.A D5.A D6.A D7.A D8.A D9.A D10.A D11.A D12.A D13.A D14.A D15.A D16.A D17.A D18.A D19.A D20.A D21.A D22.A D23.A D24.A JARD.GND@0(GND) JARD.GND@1(GND) JARD.GND@2(GND) JP3.5 JP3.11 JP4.5 JP4.11 JP5.5 JP5.11 JP13.10 X1.5 ; also sheet 1,2,3,4,9,10,11
JP3_1: D1.C JP3.1 R41.1
JP3_2: D2.C JP3.2 R42.1
JP3_3: D3.C JP3.3 R43.1
JP3_4: D4.C JP3.4 R44.1
JP3_7: D5.C JP3.7 R45.1
JP3_8: D6.C JP3.8 R46.1
JP3_9: D7.C JP3.9 R47.1
JP3_10: D8.C JP3.10 R48.1
JP3_VCC: JP3.6 JP3.12 JP6.2
JP4_1: D9.C JP4.1 R49.1
JP4_2: D10.C JP4.2 R50.1
JP4_3: D11.C JP4.3 R51.1
JP4_4: D12.C JP4.4 R52.1
JP4_7: D13.C JP4.7 R53.1
JP4_8: D14.C JP4.8 R54.1
JP4_9: D15.C JP4.9 R55.1
JP4_10: D16.C JP4.10 R56.1
JP4_VCC: JP4.6 JP4.12 JP7.2
JP5_1: D17.C JP5.1 R57.1
JP5_2: D18.C JP5.2 R58.1
JP5_3: D19.C JP5.3 R59.1
JP5_4: D20.C JP5.4 R60.1
JP5_7: D21.C JP5.7 R61.1
JP5_8: D22.C JP5.8 R62.1
JP5_9: D23.C JP5.9 R63.1
JP5_10: D24.C JP5.10 R64.1
JP5_VCC: JP5.6 JP5.12 JP8.2
JP13_3: JP13.3 ; also sheet 8
JP13_4: JP13.4 ; also sheet 8
JP13_5: JP13.5 ; also sheet 8
JP13_6: JP13.6 ; also sheet 8
JP13_7: JP13.7 ; also sheet 8
JP13_8: JP13.8 ; also sheet 8
JP13_9: JP13.9 ; also sheet 8
NRSTIN: JARD.RES ; also sheet 2,3
USBDM: X1.2 ; also sheet 2
USBDP: X1.3 ; also sheet 2
USBID: X1.4
VUSB: X1.1
X0D14: R56.2 ; also sheet 1
X0D15: R55.2 ; also sheet 1
X0D16: R54.2 ; also sheet 1
X0D17: R53.2 ; also sheet 1
X0D18: R52.2 ; also sheet 1
X0D19: R51.2 ; also sheet 1
X0D20: R50.2 ; also sheet 1
X0D21: R49.2 ; also sheet 1
X0D36: R48.2 ; also sheet 1
X0D37: R47.2 ; also sheet 1
X0D38: R46.2 ; also sheet 1
X0D39: R45.2 ; also sheet 1
X0D40: R44.2 ; also sheet 1
X0D41: R43.2 ; also sheet 1
X0D42: R42.2 ; also sheet 1
X0D43: R41.2 ; also sheet 1
X1D02: R64.2 ; also sheet 1
X1D03: R63.2 ; also sheet 1
X1D04: R62.2 ; also sheet 1
X1D05: R61.2 ; also sheet 1
X1D06: R60.2 ; also sheet 1
X1D07: R59.2 ; also sheet 1
X1D08: R58.2 ; also sheet 1
X1D09: R57.2 ; also sheet 1
Unconnected: JARD.AREF JARD.VIN

## Sheet 6 of 11
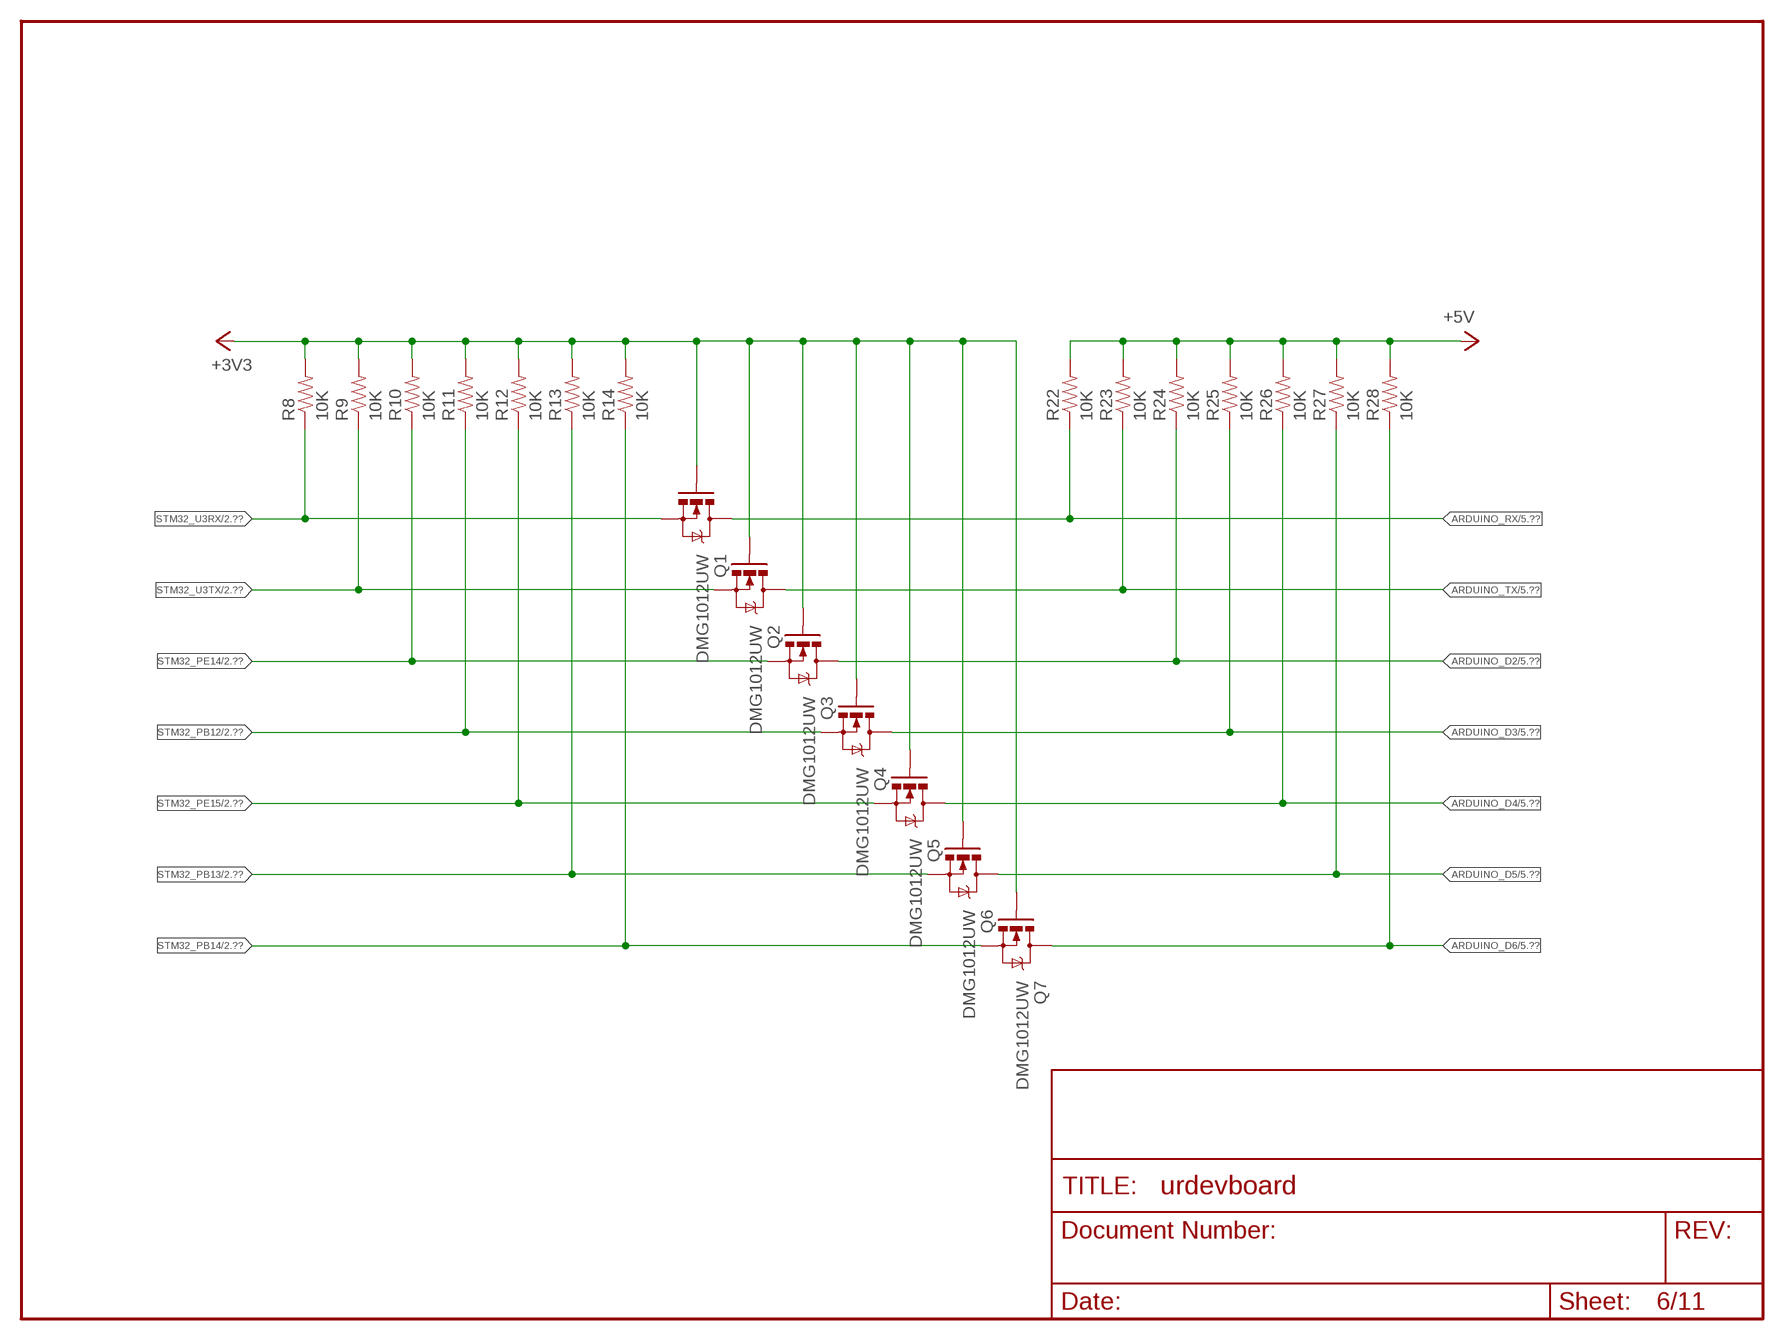
[diagram p5: schematic, sheet 6]

### Parts
Q1  DMG1012UW  MOSFET-NCHANNELSMD  [SOT23-3]
Q2  DMG1012UW  MOSFET-NCHANNELSMD  [SOT23-3]
Q3  DMG1012UW  MOSFET-NCHANNELSMD  [SOT23-3]
Q4  DMG1012UW  MOSFET-NCHANNELSMD  [SOT23-3]
Q5  DMG1012UW  MOSFET-NCHANNELSMD  [SOT23-3]
Q6  DMG1012UW  MOSFET-NCHANNELSMD  [SOT23-3]
Q7  DMG1012UW  MOSFET-NCHANNELSMD  [SOT23-3]
R8  10K  RESISTOR0603-RES  [0603-RES]
R9  10K  RESISTOR0603-RES  [0603-RES]
R10  10K  RESISTOR0603-RES  [0603-RES]
R11  10K  RESISTOR0603-RES  [0603-RES]
R12  10K  RESISTOR0603-RES  [0603-RES]
R13  10K  RESISTOR0603-RES  [0603-RES]
R14  10K  RESISTOR0603-RES  [0603-RES]
R22  10K  RESISTOR0603-RES  [0603-RES]
R23  10K  RESISTOR0603-RES  [0603-RES]
R24  10K  RESISTOR0603-RES  [0603-RES]
R25  10K  RESISTOR0603-RES  [0603-RES]
R26  10K  RESISTOR0603-RES  [0603-RES]
R27  10K  RESISTOR0603-RES  [0603-RES]
R28  10K  RESISTOR0603-RES  [0603-RES]

### Nets
+3V3: Q1.1(G) Q2.1(G) Q3.1(G) Q4.1(G) Q5.1(G) Q6.1(G) Q7.1(G) R8.2 R9.2 R10.2 R11.2 R12.2 R13.2 R14.2 ; also sheet 1,2,3,4,5,7,8,9,11
+5V: R22.2 R23.2 R24.2 R25.2 R26.2 R27.2 R28.2 ; also sheet 2,4,5,7,8
ARDUINO_D2: Q3.3(D) R24.1 ; also sheet 5
ARDUINO_D3: Q4.3(D) R25.1 ; also sheet 5
ARDUINO_D4: Q5.3(D) R26.1 ; also sheet 5
ARDUINO_D5: Q6.3(D) R27.1 ; also sheet 5
ARDUINO_D6: Q7.3(D) R28.1 ; also sheet 5
ARDUINO_RX: Q1.3(D) R22.1 ; also sheet 5
ARDUINO_TX: Q2.3(D) R23.1 ; also sheet 5
STM32_PB12: Q4.2(S) R11.1 ; also sheet 2
STM32_PB13: Q6.2(S) R13.1 ; also sheet 2
STM32_PB14: Q7.2(S) R14.1 ; also sheet 2
STM32_PE14: Q3.2(S) R10.1 ; also sheet 2
STM32_PE15: Q5.2(S) R12.1 ; also sheet 2
STM32_U3RX: Q1.2(S) R8.1 ; also sheet 2
STM32_U3TX: Q2.2(S) R9.1 ; also sheet 2

## Sheet 7 of 11
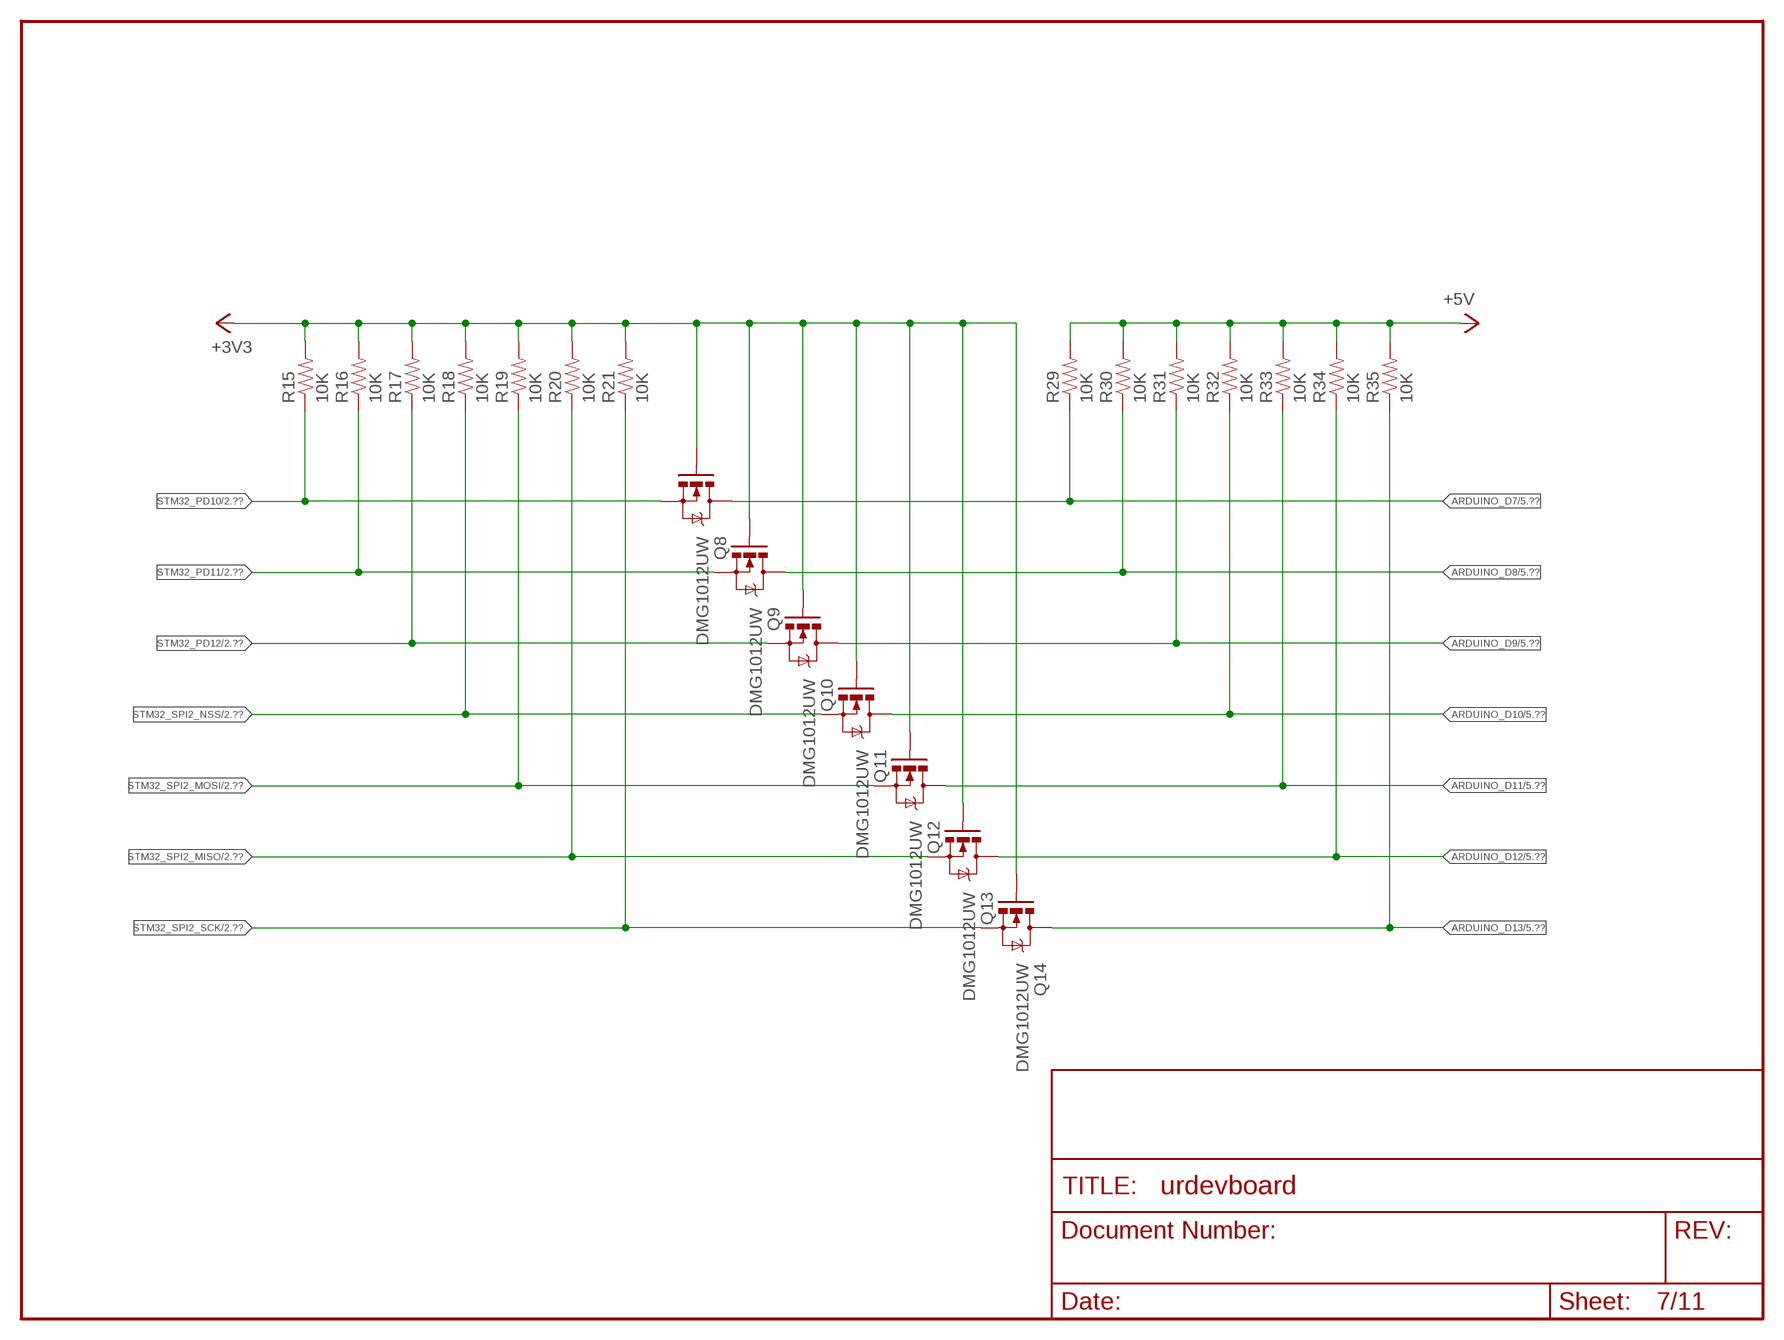
[diagram p6: schematic, sheet 7]

### Parts
Q8  DMG1012UW  MOSFET-NCHANNELSMD  [SOT23-3]
Q9  DMG1012UW  MOSFET-NCHANNELSMD  [SOT23-3]
Q10  DMG1012UW  MOSFET-NCHANNELSMD  [SOT23-3]
Q11  DMG1012UW  MOSFET-NCHANNELSMD  [SOT23-3]
Q12  DMG1012UW  MOSFET-NCHANNELSMD  [SOT23-3]
Q13  DMG1012UW  MOSFET-NCHANNELSMD  [SOT23-3]
Q14  DMG1012UW  MOSFET-NCHANNELSMD  [SOT23-3]
R15  10K  RESISTOR0603-RES  [0603-RES]
R16  10K  RESISTOR0603-RES  [0603-RES]
R17  10K  RESISTOR0603-RES  [0603-RES]
R18  10K  RESISTOR0603-RES  [0603-RES]
R19  10K  RESISTOR0603-RES  [0603-RES]
R20  10K  RESISTOR0603-RES  [0603-RES]
R21  10K  RESISTOR0603-RES  [0603-RES]
R29  10K  RESISTOR0603-RES  [0603-RES]
R30  10K  RESISTOR0603-RES  [0603-RES]
R31  10K  RESISTOR0603-RES  [0603-RES]
R32  10K  RESISTOR0603-RES  [0603-RES]
R33  10K  RESISTOR0603-RES  [0603-RES]
R34  10K  RESISTOR0603-RES  [0603-RES]
R35  10K  RESISTOR0603-RES  [0603-RES]

### Nets
+3V3: Q8.1(G) Q9.1(G) Q10.1(G) Q11.1(G) Q12.1(G) Q13.1(G) Q14.1(G) R15.2 R16.2 R17.2 R18.2 R19.2 R20.2 R21.2 ; also sheet 1,2,3,4,5,6,8,9,11
+5V: R29.2 R30.2 R31.2 R32.2 R33.2 R34.2 R35.2 ; also sheet 2,4,5,6,8
ARDUINO_D7: Q8.3(D) R29.1 ; also sheet 5
ARDUINO_D8: Q9.3(D) R30.1 ; also sheet 5
ARDUINO_D9: Q10.3(D) R31.1 ; also sheet 5
ARDUINO_D10: Q11.3(D) R32.1 ; also sheet 5
ARDUINO_D11: Q12.3(D) R33.1 ; also sheet 5
ARDUINO_D12: Q13.3(D) R34.1 ; also sheet 5
ARDUINO_D13: Q14.3(D) R35.1 ; also sheet 5
STM32_PD10: Q8.2(S) R15.1 ; also sheet 2
STM32_PD11: Q9.2(S) R16.1 ; also sheet 2
STM32_PD12: Q10.2(S) R17.1 ; also sheet 2
STM32_SPI2_MISO: Q13.2(S) R20.1 ; also sheet 2
STM32_SPI2_MOSI: Q12.2(S) R19.1 ; also sheet 2
STM32_SPI2_NSS: Q11.2(S) R18.1 ; also sheet 2
STM32_SPI2_SCK: Q14.2(S) R21.1 ; also sheet 2

## Sheet 8 of 11
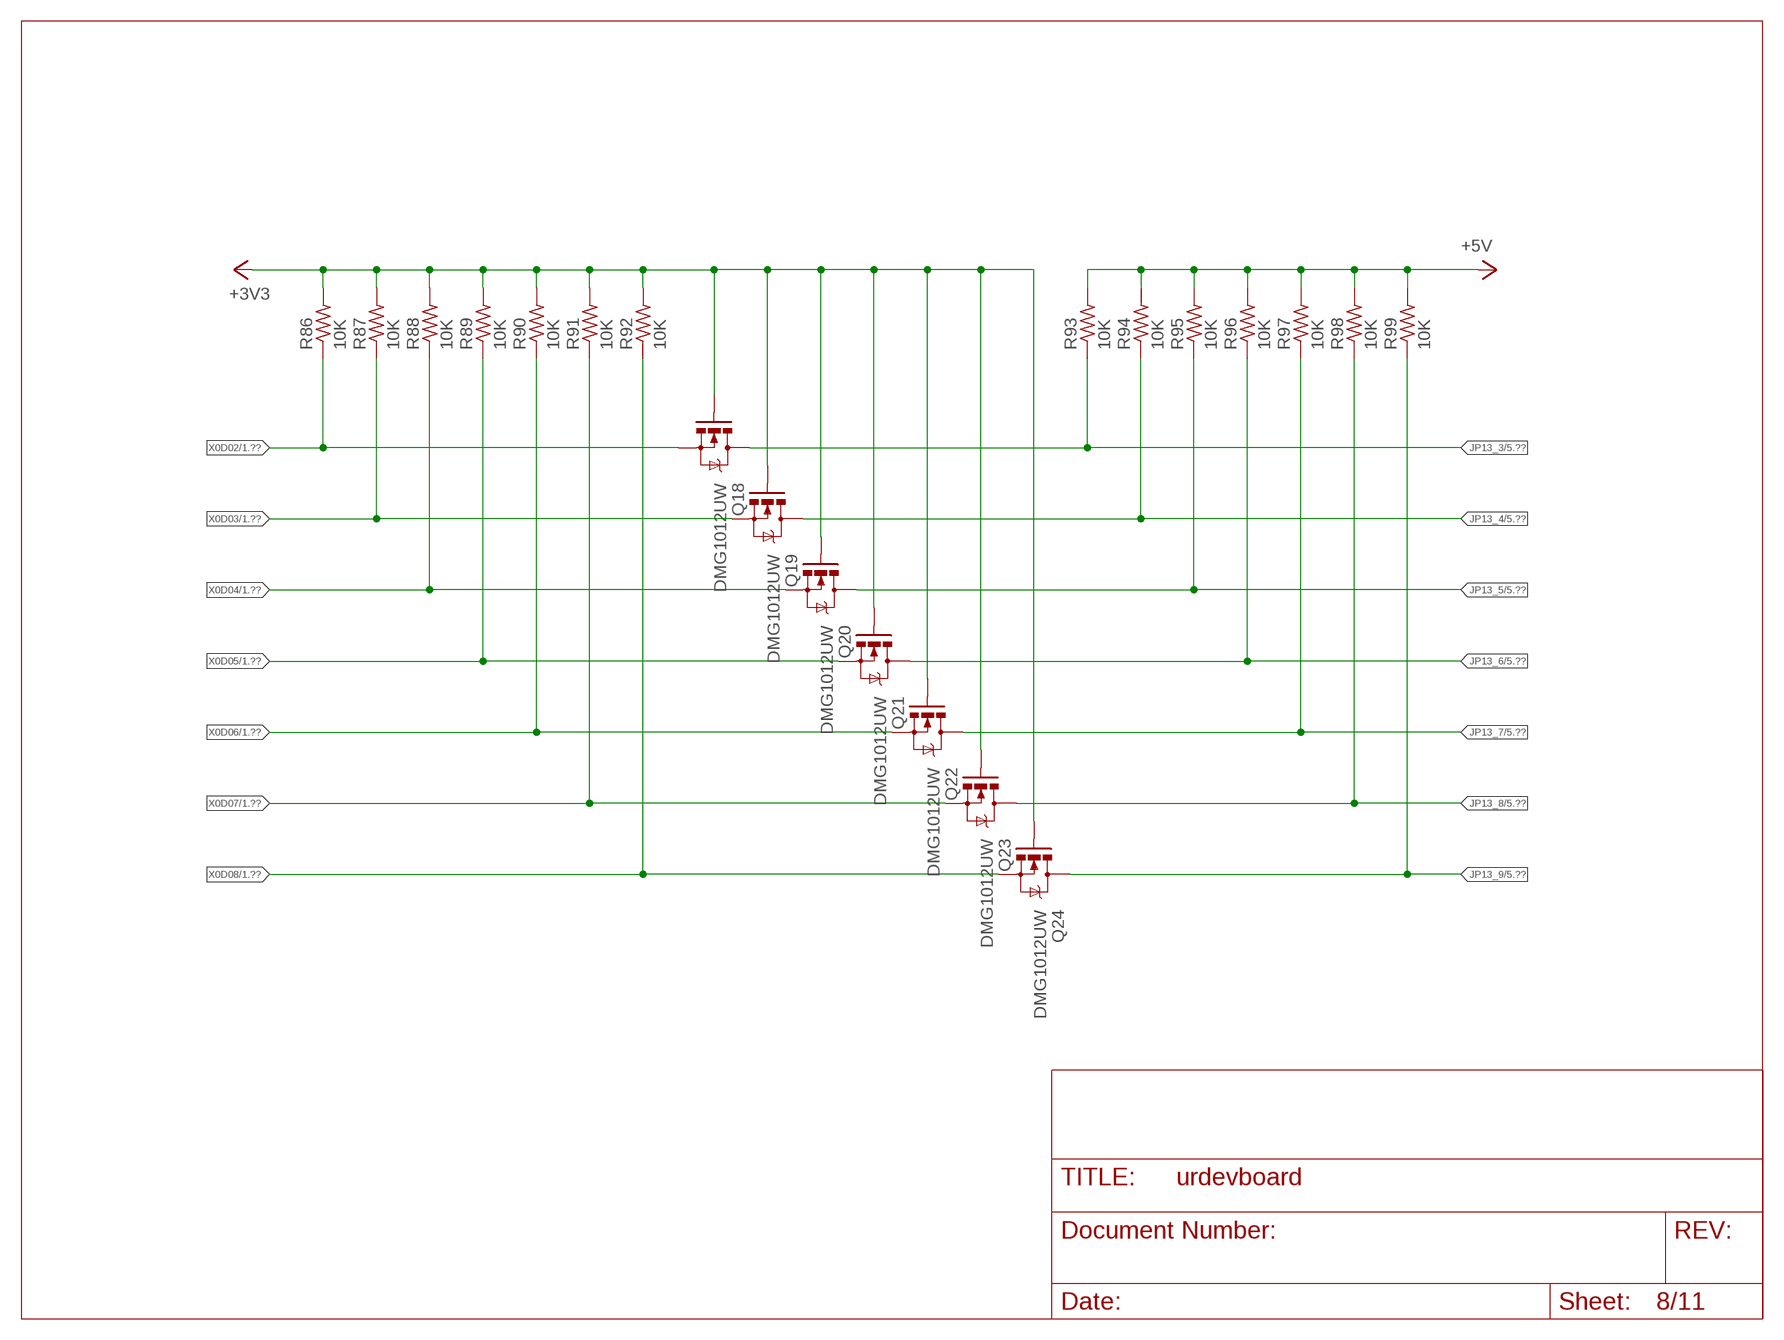
[diagram p7: schematic, sheet 8]

### Parts
Q18  DMG1012UW  MOSFET-NCHANNELSMD  [SOT23-3]
Q19  DMG1012UW  MOSFET-NCHANNELSMD  [SOT23-3]
Q20  DMG1012UW  MOSFET-NCHANNELSMD  [SOT23-3]
Q21  DMG1012UW  MOSFET-NCHANNELSMD  [SOT23-3]
Q22  DMG1012UW  MOSFET-NCHANNELSMD  [SOT23-3]
Q23  DMG1012UW  MOSFET-NCHANNELSMD  [SOT23-3]
Q24  DMG1012UW  MOSFET-NCHANNELSMD  [SOT23-3]
R86  10K  R-US_R0603  [R0603]
R87  10K  R-US_R0603  [R0603]
R88  10K  R-US_R0603  [R0603]
R89  10K  R-US_R0603  [R0603]
R90  10K  R-US_R0603  [R0603]
R91  10K  R-US_R0603  [R0603]
R92  10K  R-US_R0603  [R0603]
R93  10K  R-US_R0603  [R0603]
R94  10K  R-US_R0603  [R0603]
R95  10K  R-US_R0603  [R0603]
R96  10K  R-US_R0603  [R0603]
R97  10K  R-US_R0603  [R0603]
R98  10K  R-US_R0603  [R0603]
R99  10K  R-US_R0603  [R0603]

### Nets
+3V3: Q18.1(G) Q19.1(G) Q20.1(G) Q21.1(G) Q22.1(G) Q23.1(G) Q24.1(G) R86.2 R87.2 R88.2 R89.2 R90.2 R91.2 R92.2 ; also sheet 1,2,3,4,5,6,7,9,11
+5V: R93.2 R94.2 R95.2 R96.2 R97.2 R98.2 R99.2 ; also sheet 2,4,5,6,7
JP13_3: Q18.3(D) R93.1 ; also sheet 5
JP13_4: Q19.3(D) R94.1 ; also sheet 5
JP13_5: Q20.3(D) R95.1 ; also sheet 5
JP13_6: Q21.3(D) R96.1 ; also sheet 5
JP13_7: Q22.3(D) R97.1 ; also sheet 5
JP13_8: Q23.3(D) R98.1 ; also sheet 5
JP13_9: Q24.3(D) R99.1 ; also sheet 5
X0D02: Q18.2(S) R86.1 ; also sheet 1
X0D03: Q19.2(S) R87.1 ; also sheet 1
X0D04: Q20.2(S) R88.1 ; also sheet 1
X0D05: Q21.2(S) R89.1 ; also sheet 1
X0D06: Q22.2(S) R90.1 ; also sheet 1
X0D07: Q23.2(S) R91.1 ; also sheet 1
X0D08: Q24.2(S) R92.1 ; also sheet 1

## Sheet 9 of 11
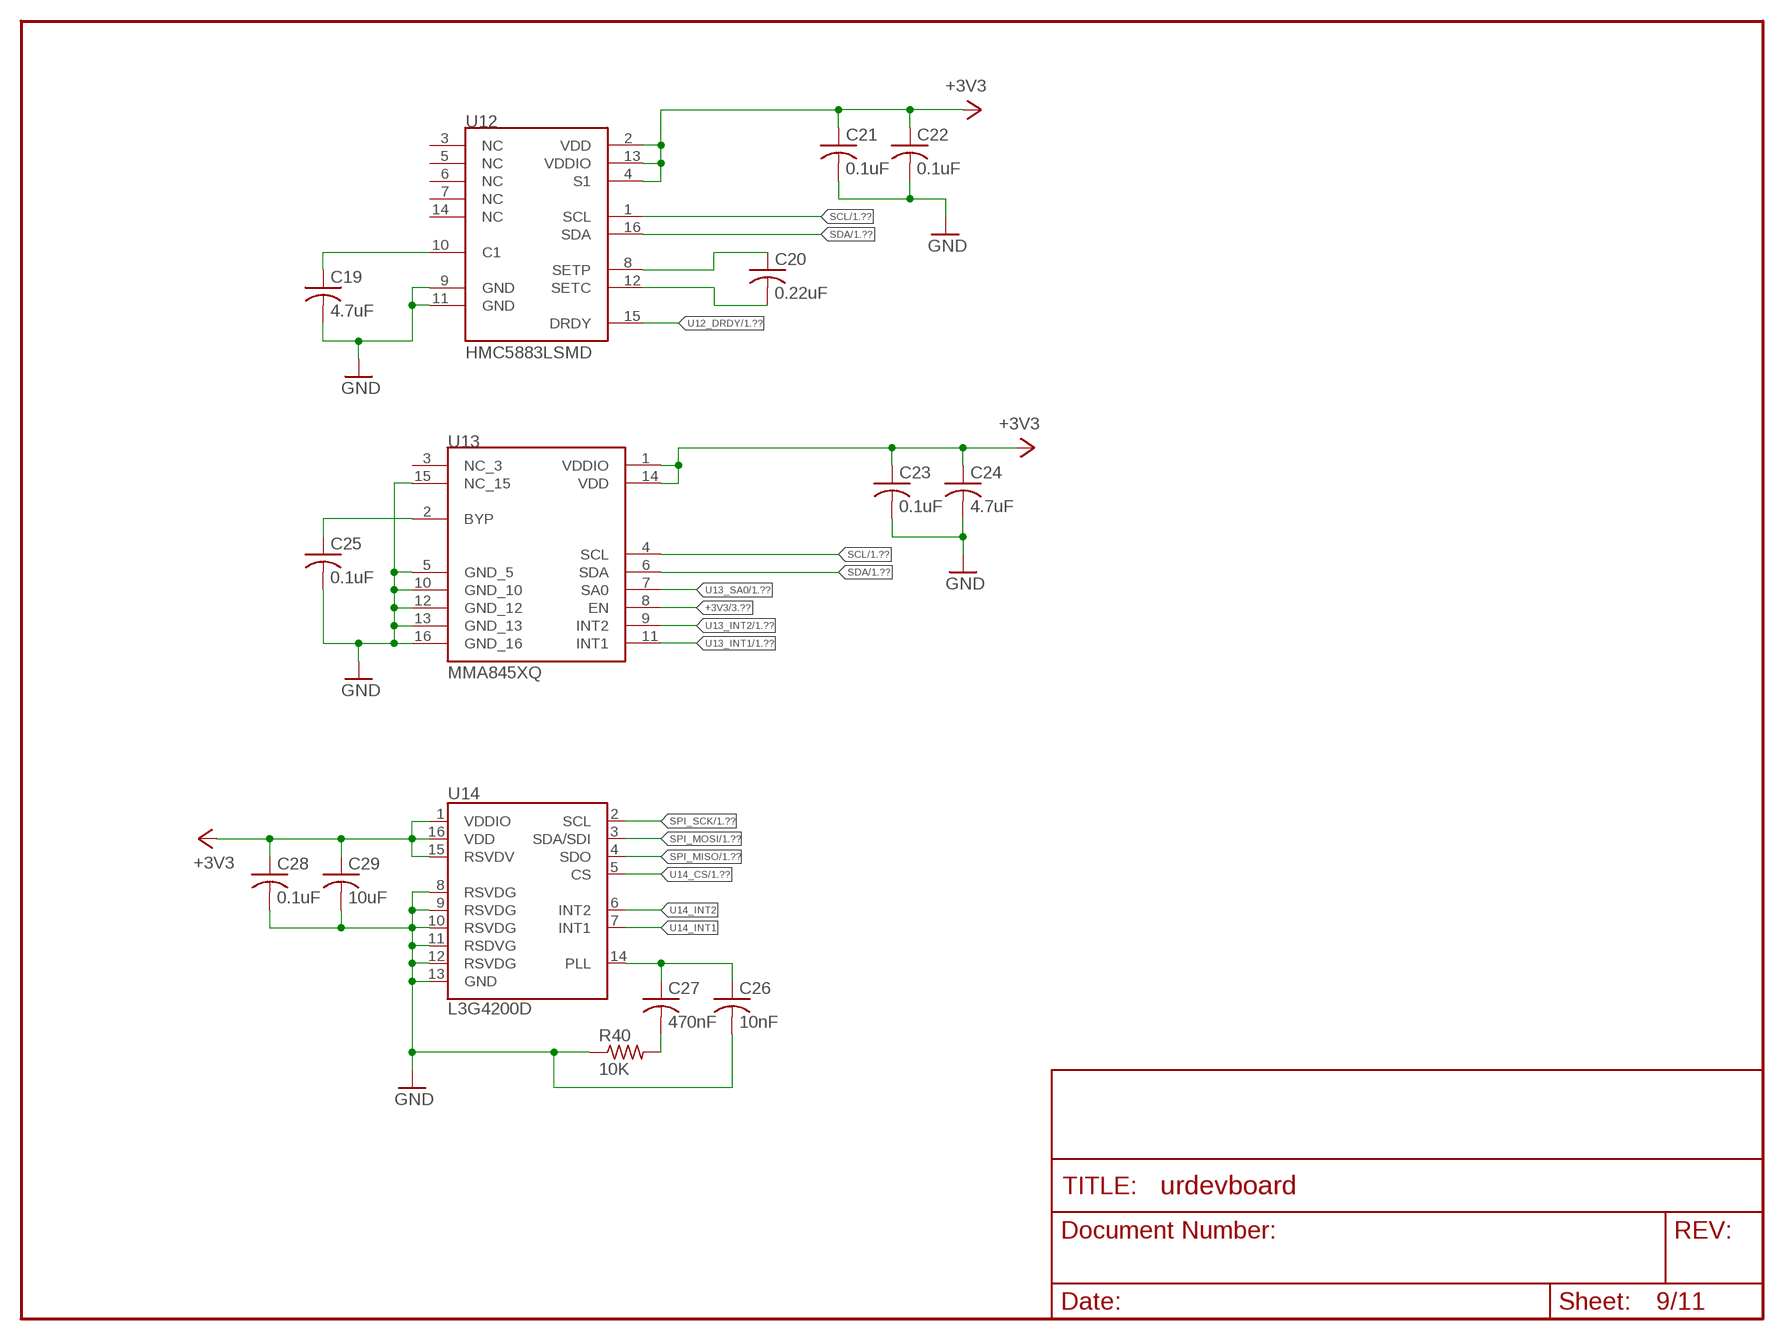
[diagram p8: schematic, sheet 9]

### Parts
C19  4.7uF  C-USC0805  [C0805]
C20  0.22uF  C-USC0603  [C0603]
C21  0.1uF  C-USC0603  [C0603]
C22  0.1uF  C-USC0603  [C0603]
C23  0.1uF  C-USC0603  [C0603]
C24  4.7uF  C-USC0805  [C0805]
C25  0.1uF  C-USC0603  [C0603]
C26  10nF  C-USC0603  [C0603]
C27  470nF  C-USC0603  [C0603]
C28  0.1uF  C-USC0603  [C0603]
C29  10uF  C-USC0805  [C0805]
R40  10K  R-US_R0603  [R0603]
U12  HMC5883LSMD  [16LPCC]
U13  MMA845XQ  [VQFN-16]
U14  L3G4200D  [LGA16-4X4]

### Nets
+3V3: C21.1 C22.1 C23.1 C24.1 C28.1 C29.1 U12.2(VDD) U12.4(S1) U12.13(VDDIO) U13.1(VDDIO) U13.8(EN) U13.14(VDD) U14.1(VDDIO) U14.15(RSVDV) U14.16(VDD) ; also sheet 1,2,3,4,5,6,7,8,11
C27_R40: C27.2 R40.2
GND: C19.2 C21.2 C22.2 C23.2 C24.2 C25.2 C26.2 C28.2 C29.2 R40.1 U12.9(GND) U12.11(GND) U13.5(GND_5) U13.10(GND_10) U13.12(GND_12) U13.13(GND_13) U13.15(NC_15) U13.16(GND_16) U14.8(RSVDG) U14.9(RSVDG) U14.10(RSVDG) U14.11(RSDVG) U14.12(RSVDG) U14.13(GND) ; also sheet 1,2,3,4,5,10,11
SCL: U12.1(SCL) U13.4(SCL) ; also sheet 1
SDA: U12.16(SDA) U13.6(SDA) ; also sheet 1
SPI_MISO: U14.4(SDO) ; also sheet 1,3
SPI_MOSI: U14.3(SDA/SDI) ; also sheet 1,3
SPI_SCK: U14.2(SCL) ; also sheet 1,3
U12_C1: C19.1 U12.10(C1)
U12_DRDY: U12.15(DRDY) ; also sheet 1
U12_SETP: C20.1 U12.8(SETP)
U12SETC: C20.2 U12.12(SETC)
U13_BYP: C25.1 U13.2(BYP)
U13_INT1: U13.11(INT1) ; also sheet 1
U13_INT2: U13.9(INT2) ; also sheet 1
U13_SA0: U13.7(SA0) ; also sheet 1
U14_CS: U14.5(CS) ; also sheet 1
U14_INT1: U14.7(INT1)
U14_INT2: U14.6(INT2)
U14_PLL: C26.1 C27.1 U14.14(PLL)
Unconnected: U12.3(NC) U12.5(NC) U12.6(NC) U12.7(NC) U12.14(NC) U13.3(NC_3)

## Sheet 10 of 11
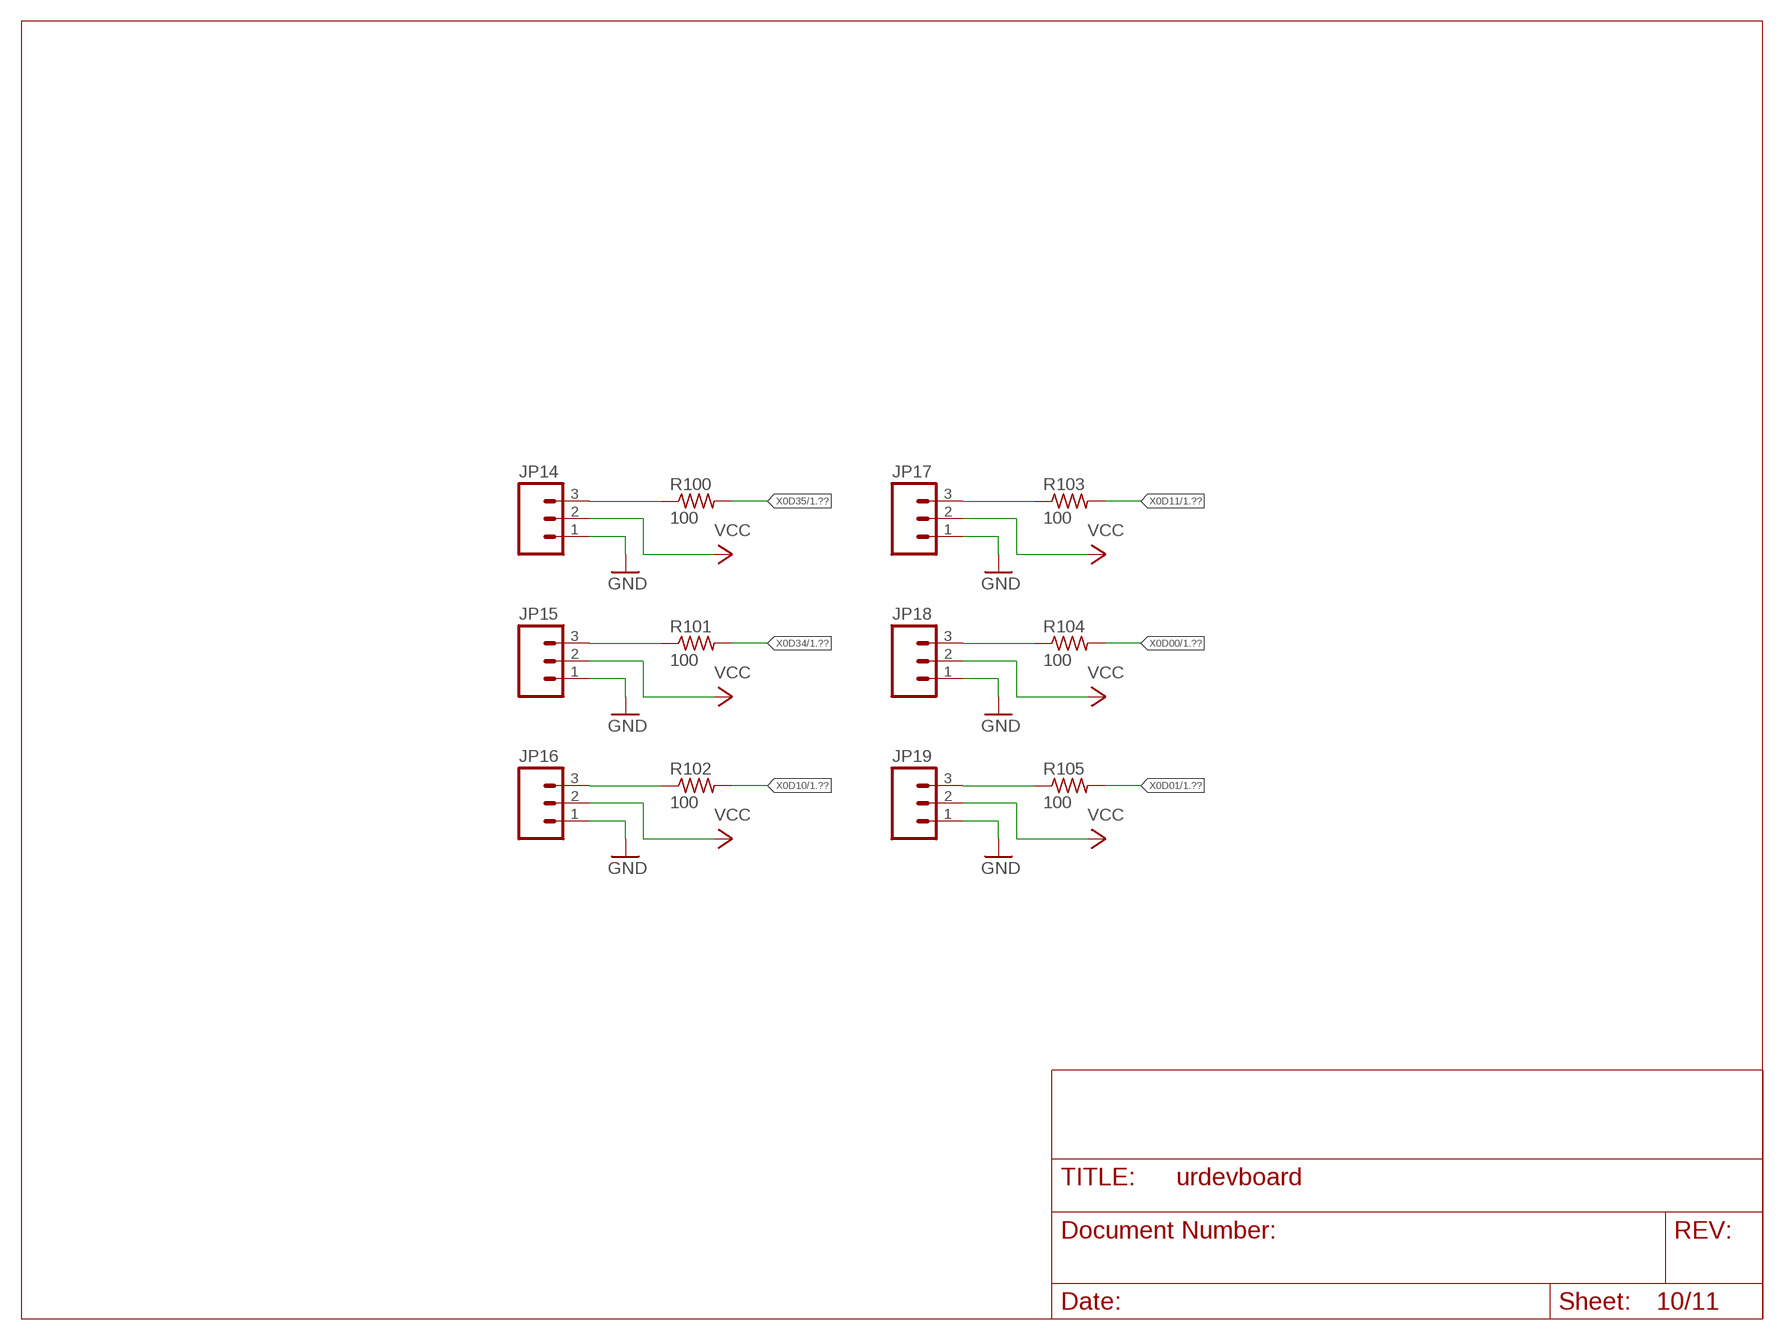
[diagram p9: schematic, sheet 10]

### Parts
JP14  M03PTH  [1X03]
JP15  M03PTH  [1X03]
JP16  M03PTH  [1X03]
JP17  M03PTH  [1X03]
JP18  M03PTH  [1X03]
JP19  M03PTH  [1X03]
R100  100  R-US_R0603  [R0603]
R101  100  R-US_R0603  [R0603]
R102  100  R-US_R0603  [R0603]
R103  100  R-US_R0603  [R0603]
R104  100  R-US_R0603  [R0603]
R105  100  R-US_R0603  [R0603]

### Nets
GND: JP14.1 JP15.1 JP16.1 JP17.1 JP18.1 JP19.1 ; also sheet 1,2,3,4,5,9,11
SERVO_0: JP14.3 R100.1
SERVO_1: JP15.3 R101.1
SERVO_2: JP16.3 R102.1
SERVO_3: JP17.3 R103.1
SERVO_4: JP18.3 R104.1
SERVO_5: JP19.3 R105.1
VCC: JP14.2 JP15.2 JP16.2 JP17.2 JP18.2 JP19.2 ; also sheet 4
X0D00: R104.2 ; also sheet 1
X0D01: R105.2 ; also sheet 1
X0D10: R102.2 ; also sheet 1
X0D11: R103.2 ; also sheet 1
X0D34: R101.2 ; also sheet 1
X0D35: R100.2 ; also sheet 1

## Sheet 11 of 11
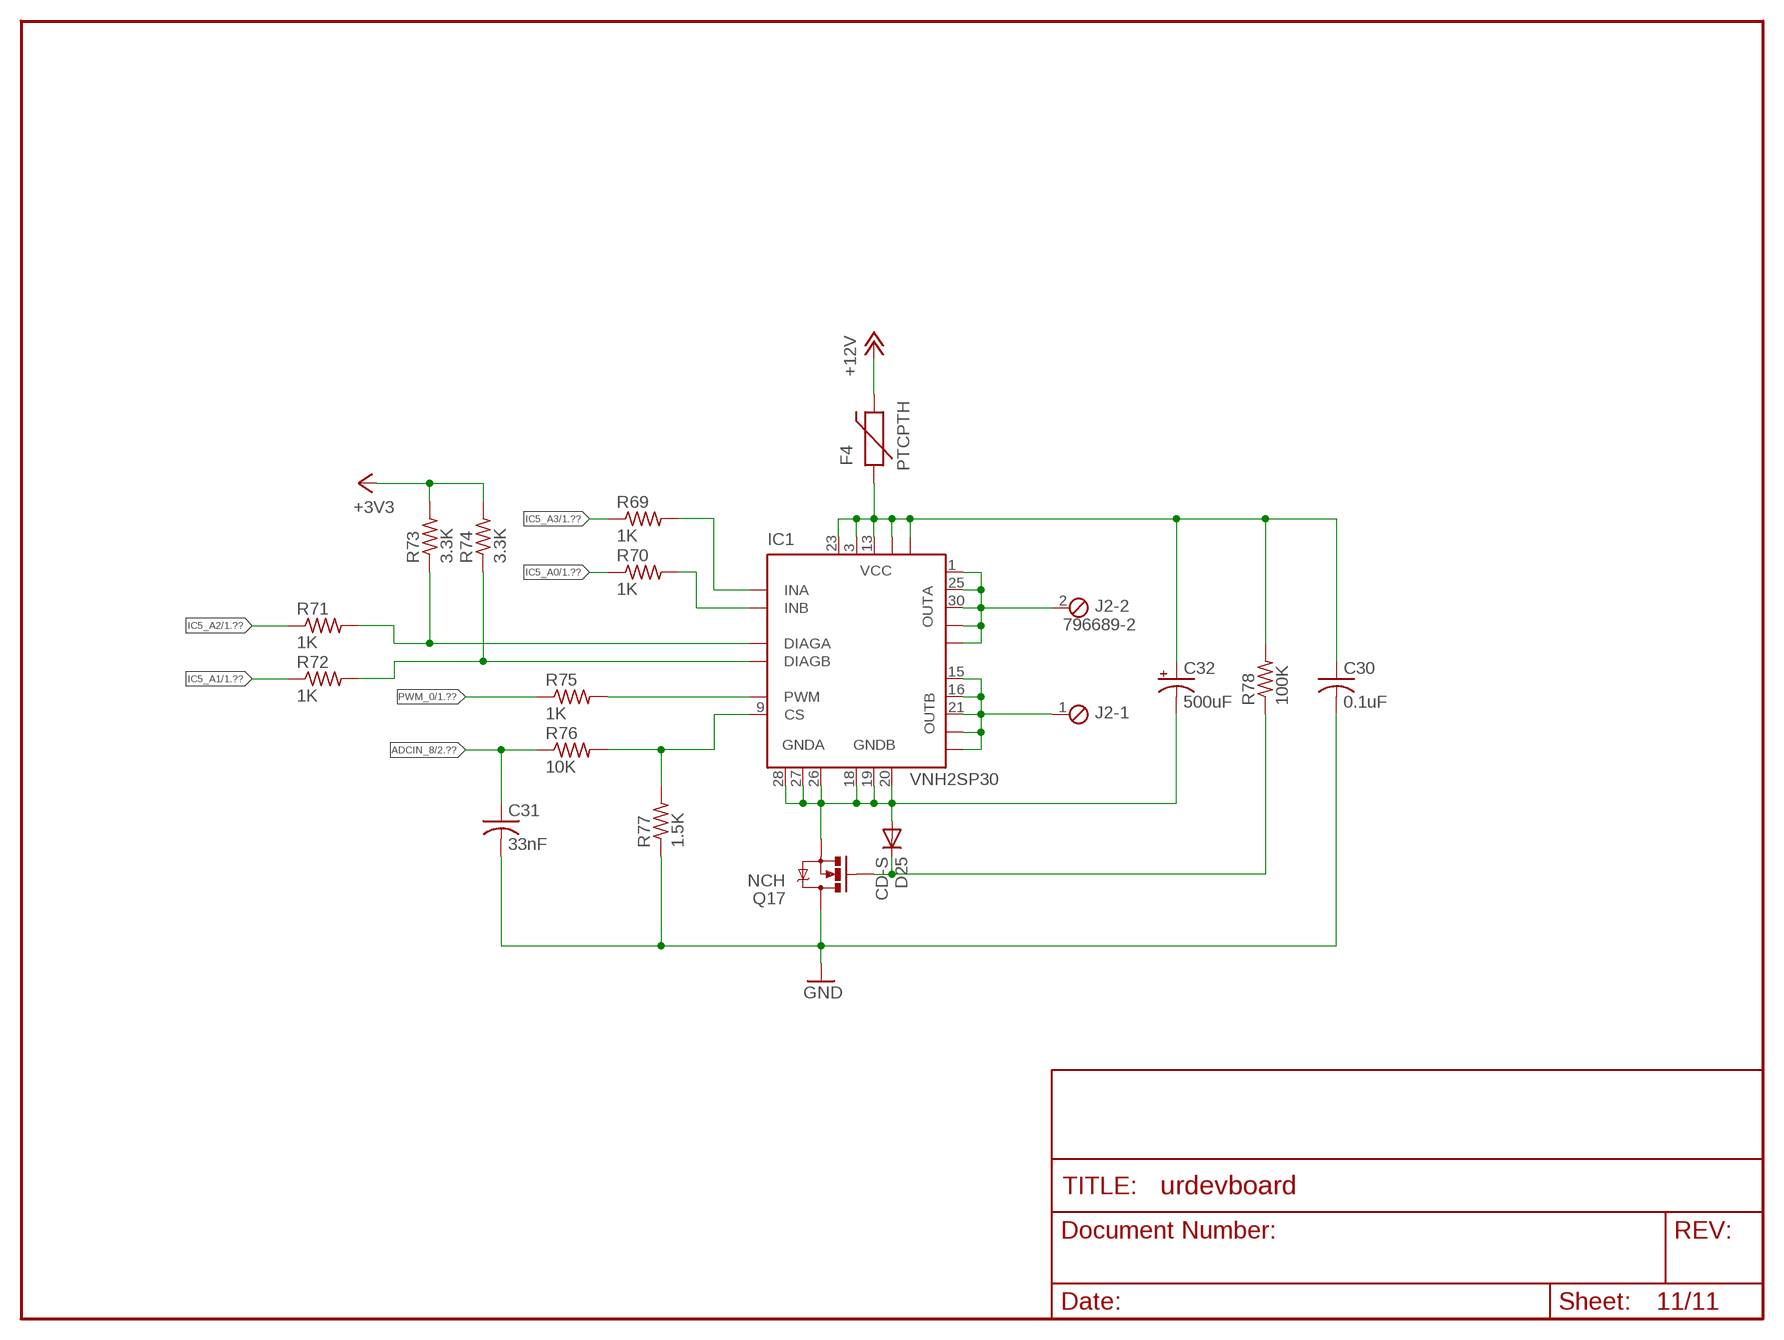
[diagram p10: schematic, sheet 11]

### Parts
C30  0.1uF  C-USC0603  [C0603]
C31  33nF  C-USC0603  [C0603]
C32  500uF  CPOL-USE2.5-6  [E2,5-6]
D25  CD-S  [D0603]
F4  PTCPTH  [PTC]
IC1  VNH2SP30  [MULTIPOWERSO-30]
J2  796689-2  [796689-2]
Q17  NCH  MOSFET-NCHANNELPTH2  [TO220V]
R69  1K  R-US_R0603  [R0603]
R70  1K  R-US_R0603  [R0603]
R71  1K  R-US_R0603  [R0603]
R72  1K  R-US_R0603  [R0603]
R73  3.3K  R-US_R0603  [R0603]
R74  3.3K  R-US_R0603  [R0603]
R75  1K  R-US_R0603  [R0603]
R76  10K  R-US_R0603  [R0603]
R77  1.5K  R-US_R0603  [R0603]
R78  100K  R-US_R0603  [R0603]

### Nets
+3V3: R73.2 R74.2 ; also sheet 1,2,3,4,5,6,7,8,9
+12V: F4.P$2 ; also sheet 4
ADCIN_8: C31.1 R76.1 ; also sheet 2
GND: C30.2 C31.2 Q17.2(D) R77.1 ; also sheet 1,2,3,4,5,9,10
IC1_CS: IC1.9(CS) R76.2 R77.2
IC1_DIAGA: IC1.6(DIAGA) R71.2 R73.1
IC1_DIAGB: IC1.10(DIAGB) R72.2 R74.1
IC1_GND: C32.- D25.A IC1.18(GNDB) IC1.19(GNDB) IC1.20(GNDB) IC1.26(GNDA) IC1.27(GNDA) IC1.28(GNDA) Q17.3(S)
IC1_INA: IC1.5(INA) R69.2
IC1_INB: IC1.11(INB) R70.2
IC1_OUTA: IC1.1(OUTA) IC1.25(OUTA) IC1.30(OUTA) IC1.OUTA IC1.OUTA@1(OUTA) J2.2
IC1_OUTB: IC1.15(OUTB) IC1.16(OUTB) IC1.21(OUTB) IC1.OUTB IC1.OUTB@1(OUTB) J2.1
IC1_PWM: IC1.8(PWM) R75.2
IC1_VCC: C30.1 C32.+ F4.P$1 IC1.3(VCC) IC1.13(VCC) IC1.23(VCC) IC1.VCC IC1.VCC@1(VCC) R78.2
IC5_A0: R70.1 ; also sheet 1
IC5_A1: R72.1 ; also sheet 1
IC5_A2: R71.1 ; also sheet 1
IC5_A3: R69.1 ; also sheet 1
PWM_0: R75.1 ; also sheet 1
Q17G: D25.C Q17.1(G) R78.1

## Power pins joined to a net without a drawn wire
VDD: U2.6(VLCD:VDD)

## Library data of the parts
C1-C31 C33-C36 = rcl:C-US: CAPACITOR, American symbol
C32 C37 = rcl:CPOL-US: POLARIZED CAPACITOR, American symbol
D1-D24 D26 D27 = diode:CDBU0130R: SMD Schottky Barrier Diode Io = 100 mA VR = 30 Volts
D25 = diode:CD-S*: BOURNS SMALL SIGNAL SWITCHING DIODE http://www.mouser.com/catalog/supplier/library/pdf/BournsChipDiodes.pdf
F1-F4 = SparkFun:PTC: Resettable Fuse PTC Resettable Fuse. Spark Fun Electronics SKU : COM-08357
IC1 = st-microelectronics:VNH2SP30: FULLY INTEGRATED H-BRIDGE MOTOR DRIVER Source: http://pdf1.alldatasheet.com/datasheet-pdf/view/84563/STMICROELECTRONICS/VNH2SP30.html
IC5 = microchip:MCP23017: http://ww1.microchip.com/downloads/en/DeviceDoc/21952a.pdf Source: http://ww1.microchip.com/downloads/en/DeviceDoc/21952a.pdf
J1 J2 = con-tyco:796689-2: TERMINAL BLOCK 5 mm, Euro Style
JARD = SparkFun:ARDUINO_SHIELD
JP1 JP2 = pinhead:PINHD-2X10: PIN HEADER
JP3-JP5 = pinhead:PINHD-2X6: PIN HEADER
JP6-JP8 = pinhead:PINHD-1X3: PIN HEADER
JP9-JP12 JP14-JP19 = SparkFun:M03: Header 3 Standard 3-pin 0.1" header. Use with straight break away headers (SKU : PRT-00116), right angle break away headers (PRT-00553), swiss pins (PRT-00743), machine pins (PRT-00117), and female headers (PRT-00115). Molex polarized connector foot print use with SKU : PRT-08232 with associated crimp pins and housings.
JP13 = con-samtec:SHF-105-01-L-D-SM: SHF-105-01-L-D-SM Connector used for Microsoft .NET Gadgeteer mainboards.
JP20 = SparkFun:M02: Header 2 Standard 2-pin 0.1" header. Use with straight break away headers (SKU : PRT-00116), right angle break away headers (PRT-00553), swiss pins (PRT-00743), machine pins (PRT-00117), and female headers (PRT-00115). Molex polarized connector foot print use with SKU : PRT-08233 with associated crimp pins and housings.
L1-L4 = rcl:L-US: INDUCTOR, American symbol
Q1-Q14 Q17-Q24 = SparkFun:MOSFET-NCHANNEL
Q15 Q16 = auv:IRF7509: N/P-Channel dual MOSFET in Micro8 package.
R1 R5-R7 R36-R109 = rcl:R-US_: RESISTOR, American symbol
R2-R4 R8-R35 = SparkFun:RESISTOR: Resistor Basic schematic elements and footprints for 0603, 1206, and PTH resistors.
U1 = XMOS:XS1-L2-SPLIT
U2 = st-microelectronics:STM32L15XVX: Ultra low power ARM-based 32-bit MCU Up to 128 KB Flash, TC, LCD, USB, USART, I2C, SPI, timers, ADC, DAC, comparators TQFP-100
U3 = SparkFun:INVERTER: Single inverter, SOT23-5
U4 = microchip:25*: Serial EEPROM 4 K, SPI bus
U5 = SparkFun:MC34063
U6 = aos:AOZ1036: EZBuck 5A Synchronous Buck Regulator
U7 = fairchild-semic:FAN2012: 1.5A Low Voltage Current Mode Synchronous PWM Buck Regulator
U8 = texas:TPS5431: 3-A,WIDE INPUT RANGE,STEP-DOWN SWIFT CONVERTER
U12 = SparkFun:HMC5883L: 3 Axis Digital Compass IC
U13 = freescale:MMA845XQ: 3-Axis, 12-bit/8-bit Digital Accelerometer
U14 = SparkFun:L3G4200D: L3G4200D Three-axis, digital output gyroscope The L3G4200D is a low-power three-axis angular rate sensor, has a full scale of ±250/±500/±2000 dps and is capable of measuring rates with a user-selectable bandwidth. It includes a sensing element and an IC interface capable of providing the measured angular rate to the external world through a digital interface (I2C/SPI). Package: 4x4x1.1 LGA-16 (LGA16-4x4.PAC)
X1 = con-hirose:MINI-USB-: MINI USB Connector Source: http://www.hirose.co.jp/cataloge_hp/e24000019.pdf
X2 = SparkFun:USD-SOCKET: microSD Socket Push-push type uSD socket. Schematic element and footprint production proven. Spark Fun Electronics SKU : PRT-00127. tDoc lines correctly indicate media card edge positions when inserting (unlocked, locked, depressed).
Y1 Y2 = SparkFun:CRYSTAL: Crystals Various standard crystals. Proven footprints. Spark Fun Electronics SKU : COM-00534